# EasyEDA Pro project ProDoc_遥控器_2026-09-13.epro

# Schematic Schematic2

## Sheets
1 MCU: Assembly Variant: Basic; Board Name: Board2; Create Date: 2026-02-01; Page Name: P1; Project Name: stm32_无人机; Schematic Name: Schematic2; Update Date: 2026-02-01; Company: 嘉立创EDA; Page Size: A4; Version: V1.0
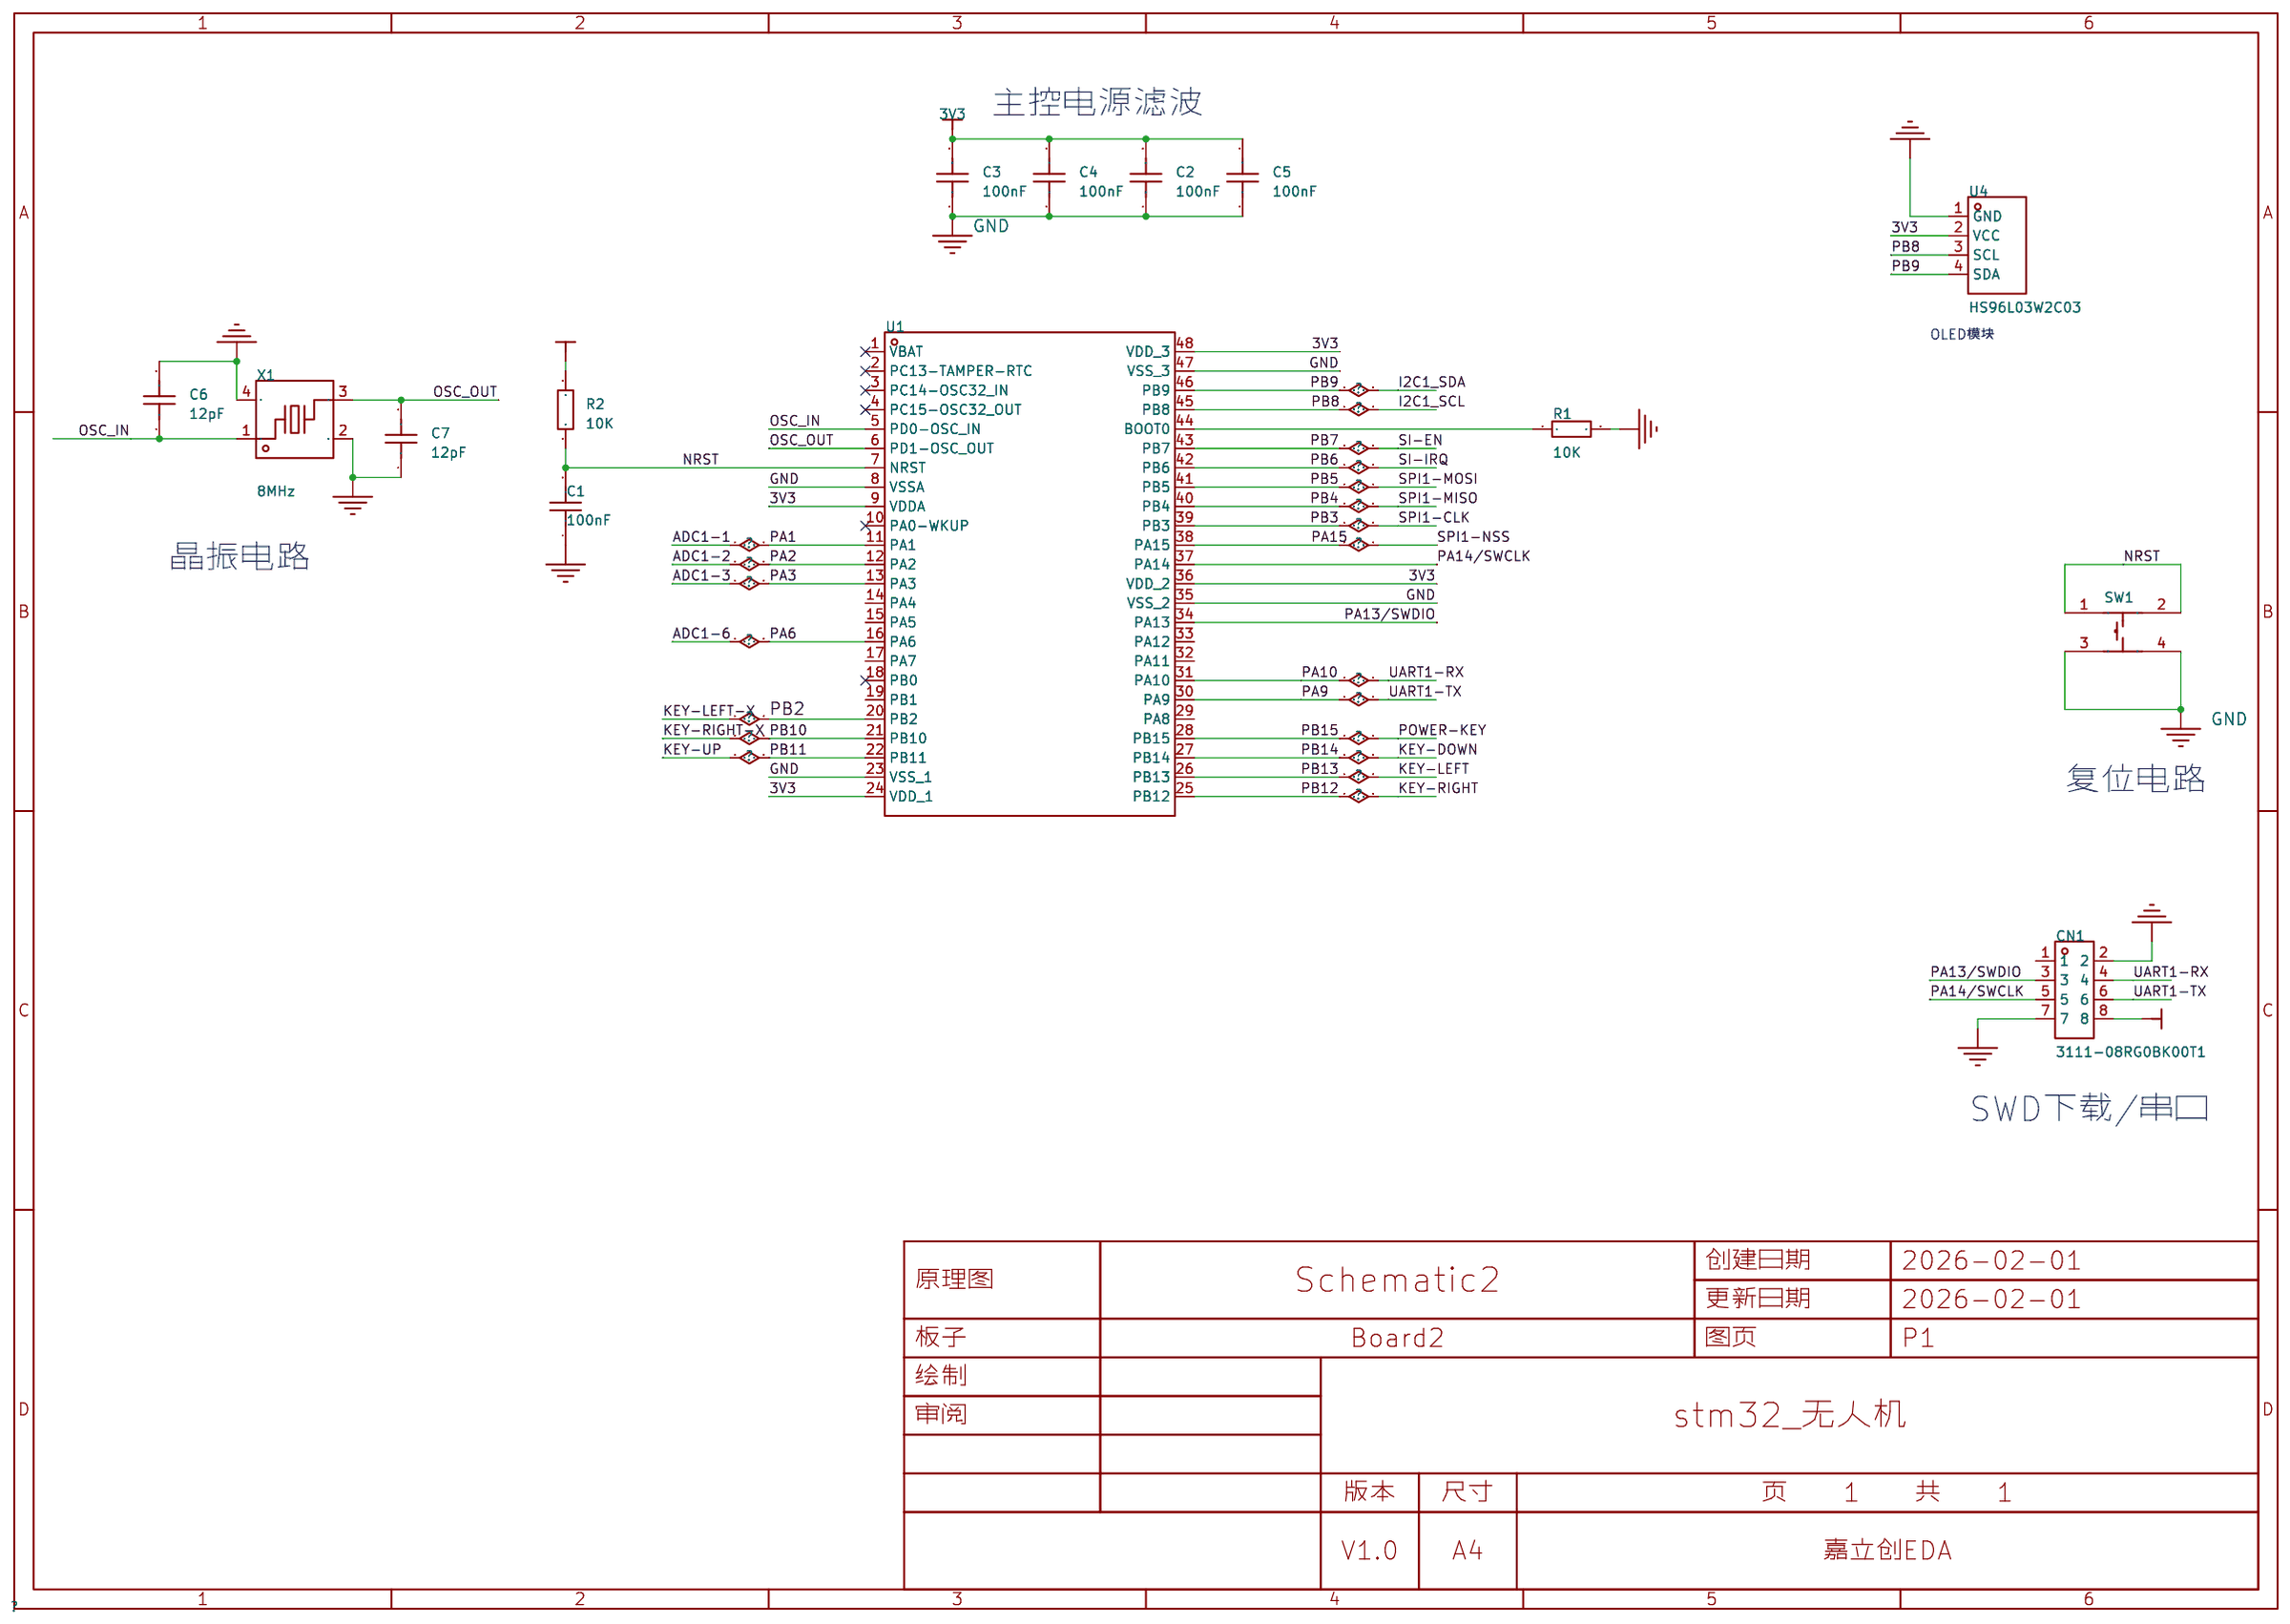
[diagram p0: MCU]
2 摇杆和按键: Board Name: 遥控器
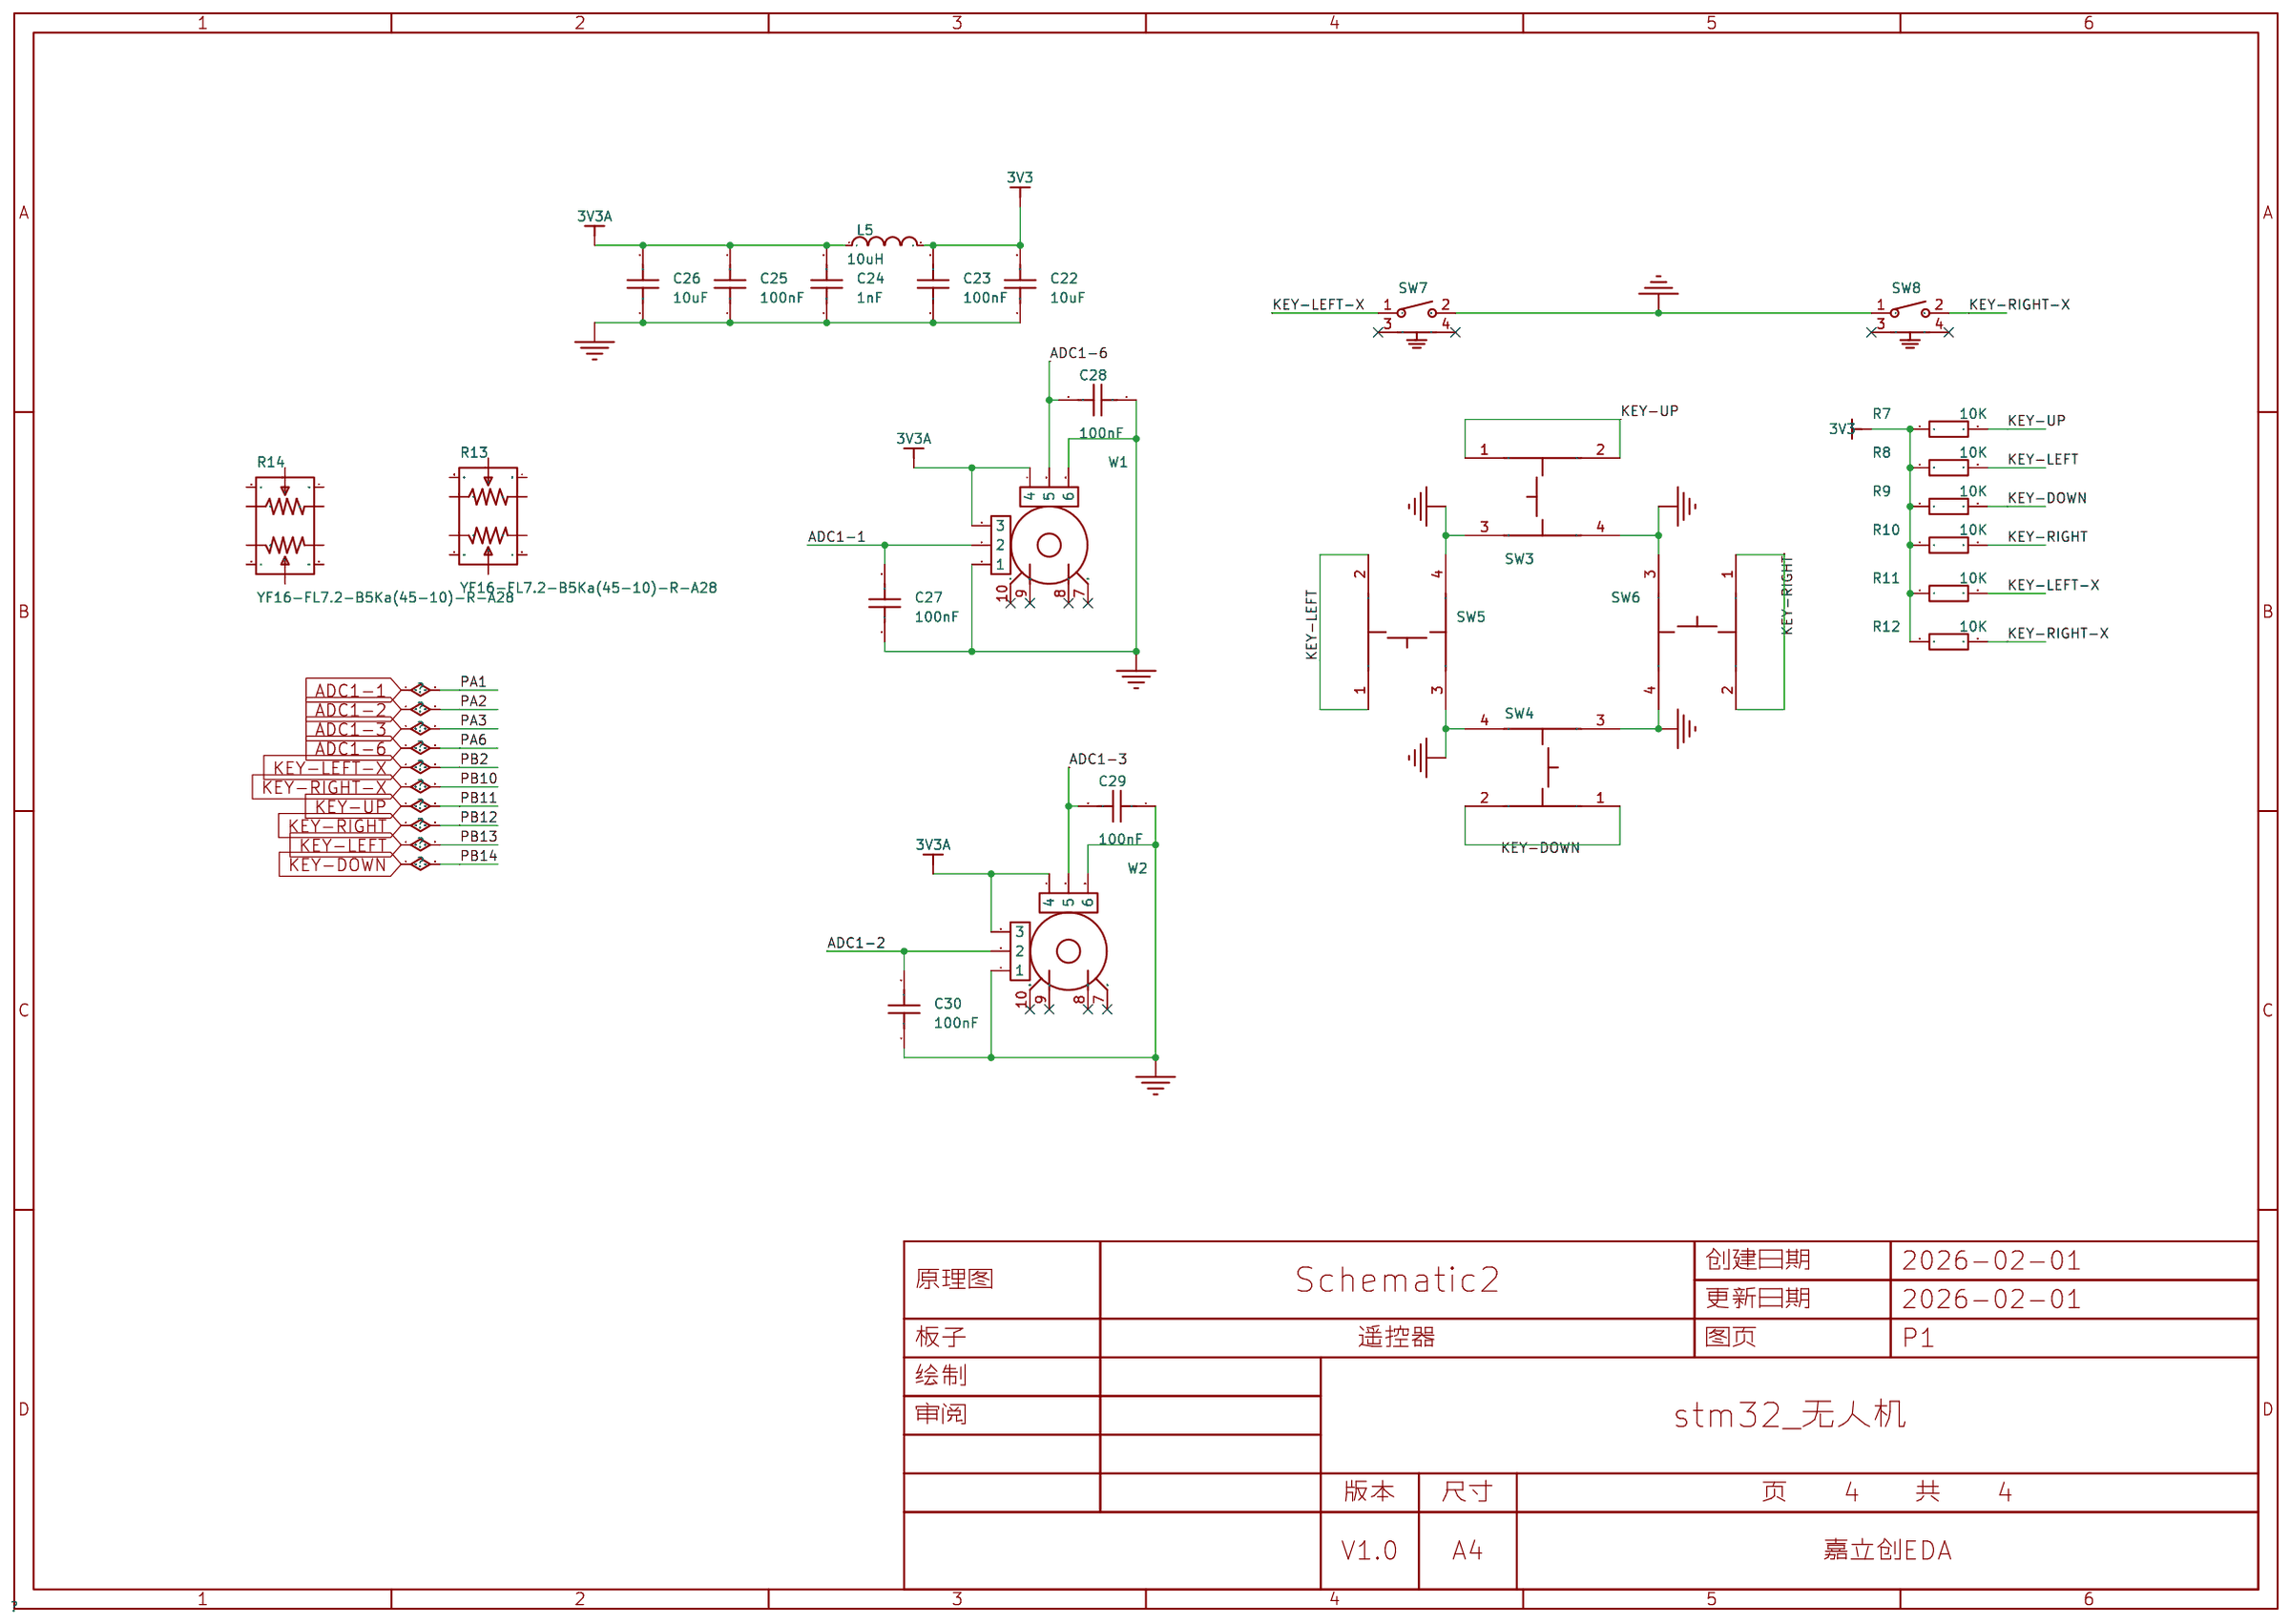
[diagram p1: 摇杆和按键]
3 SI24R1: Board Name: 遥控器
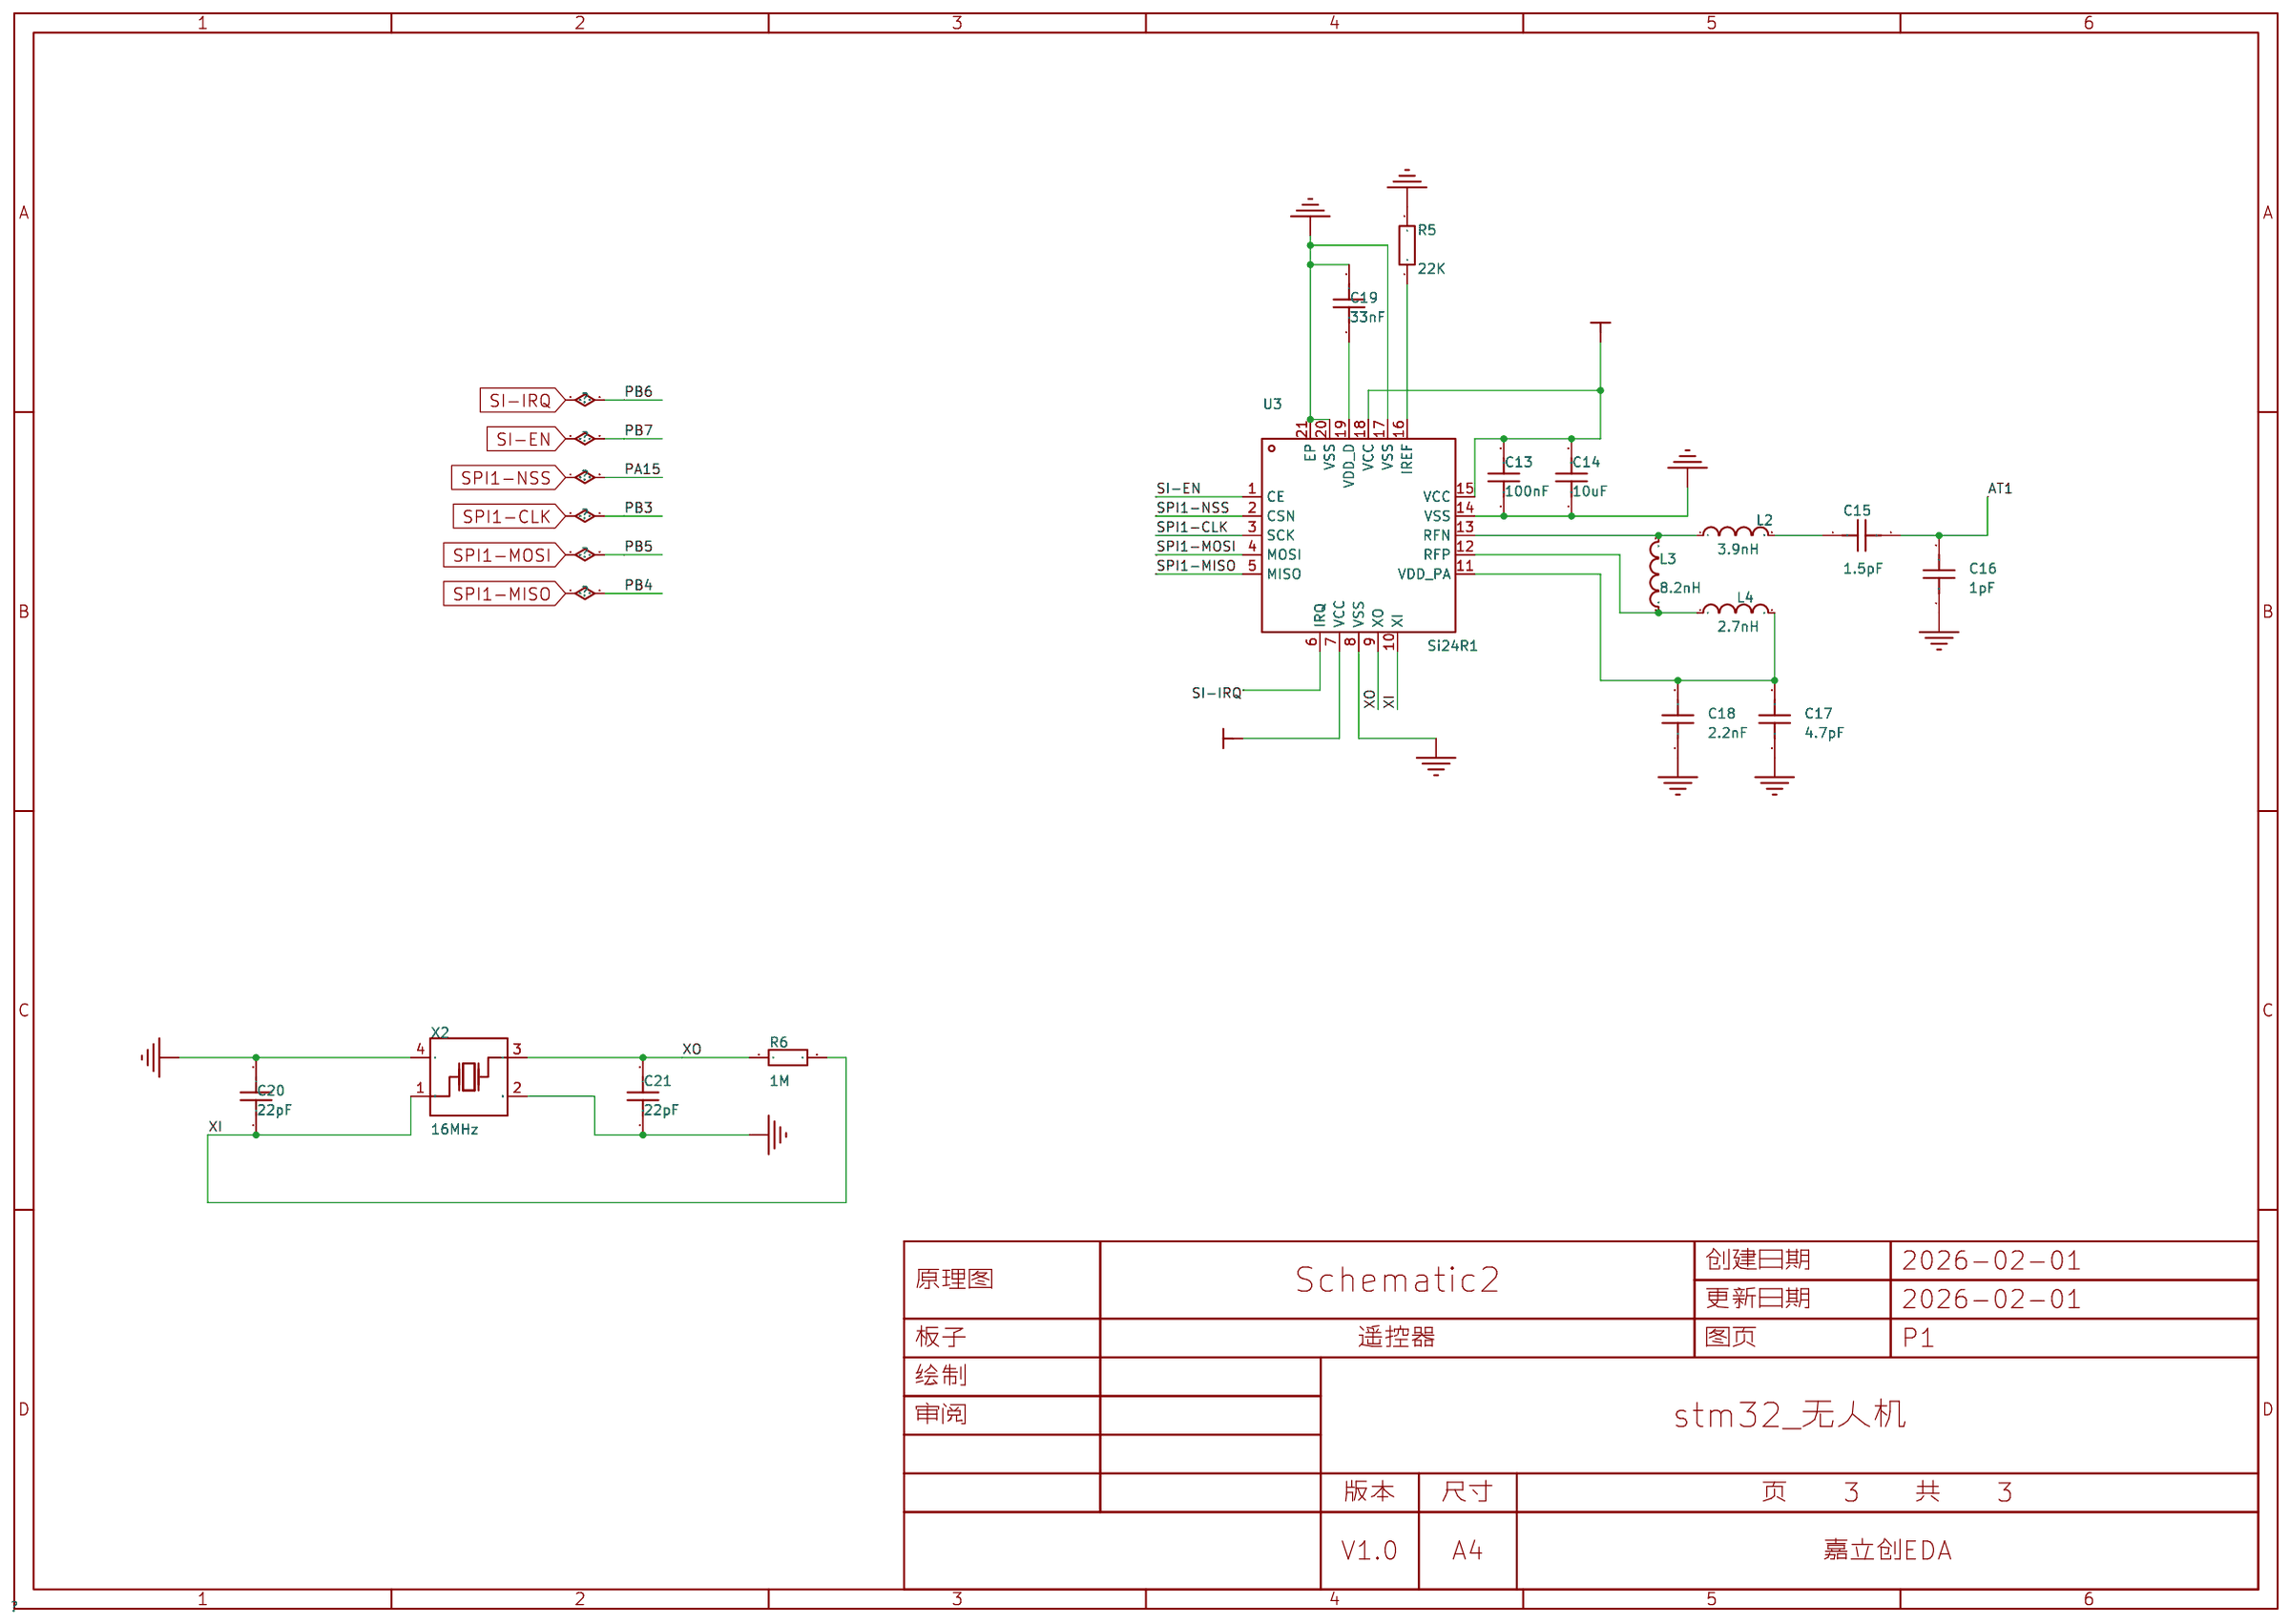
[diagram p2: SI24R1]
4 电源充电管理: Board Name: 遥控器; Page Name: P2
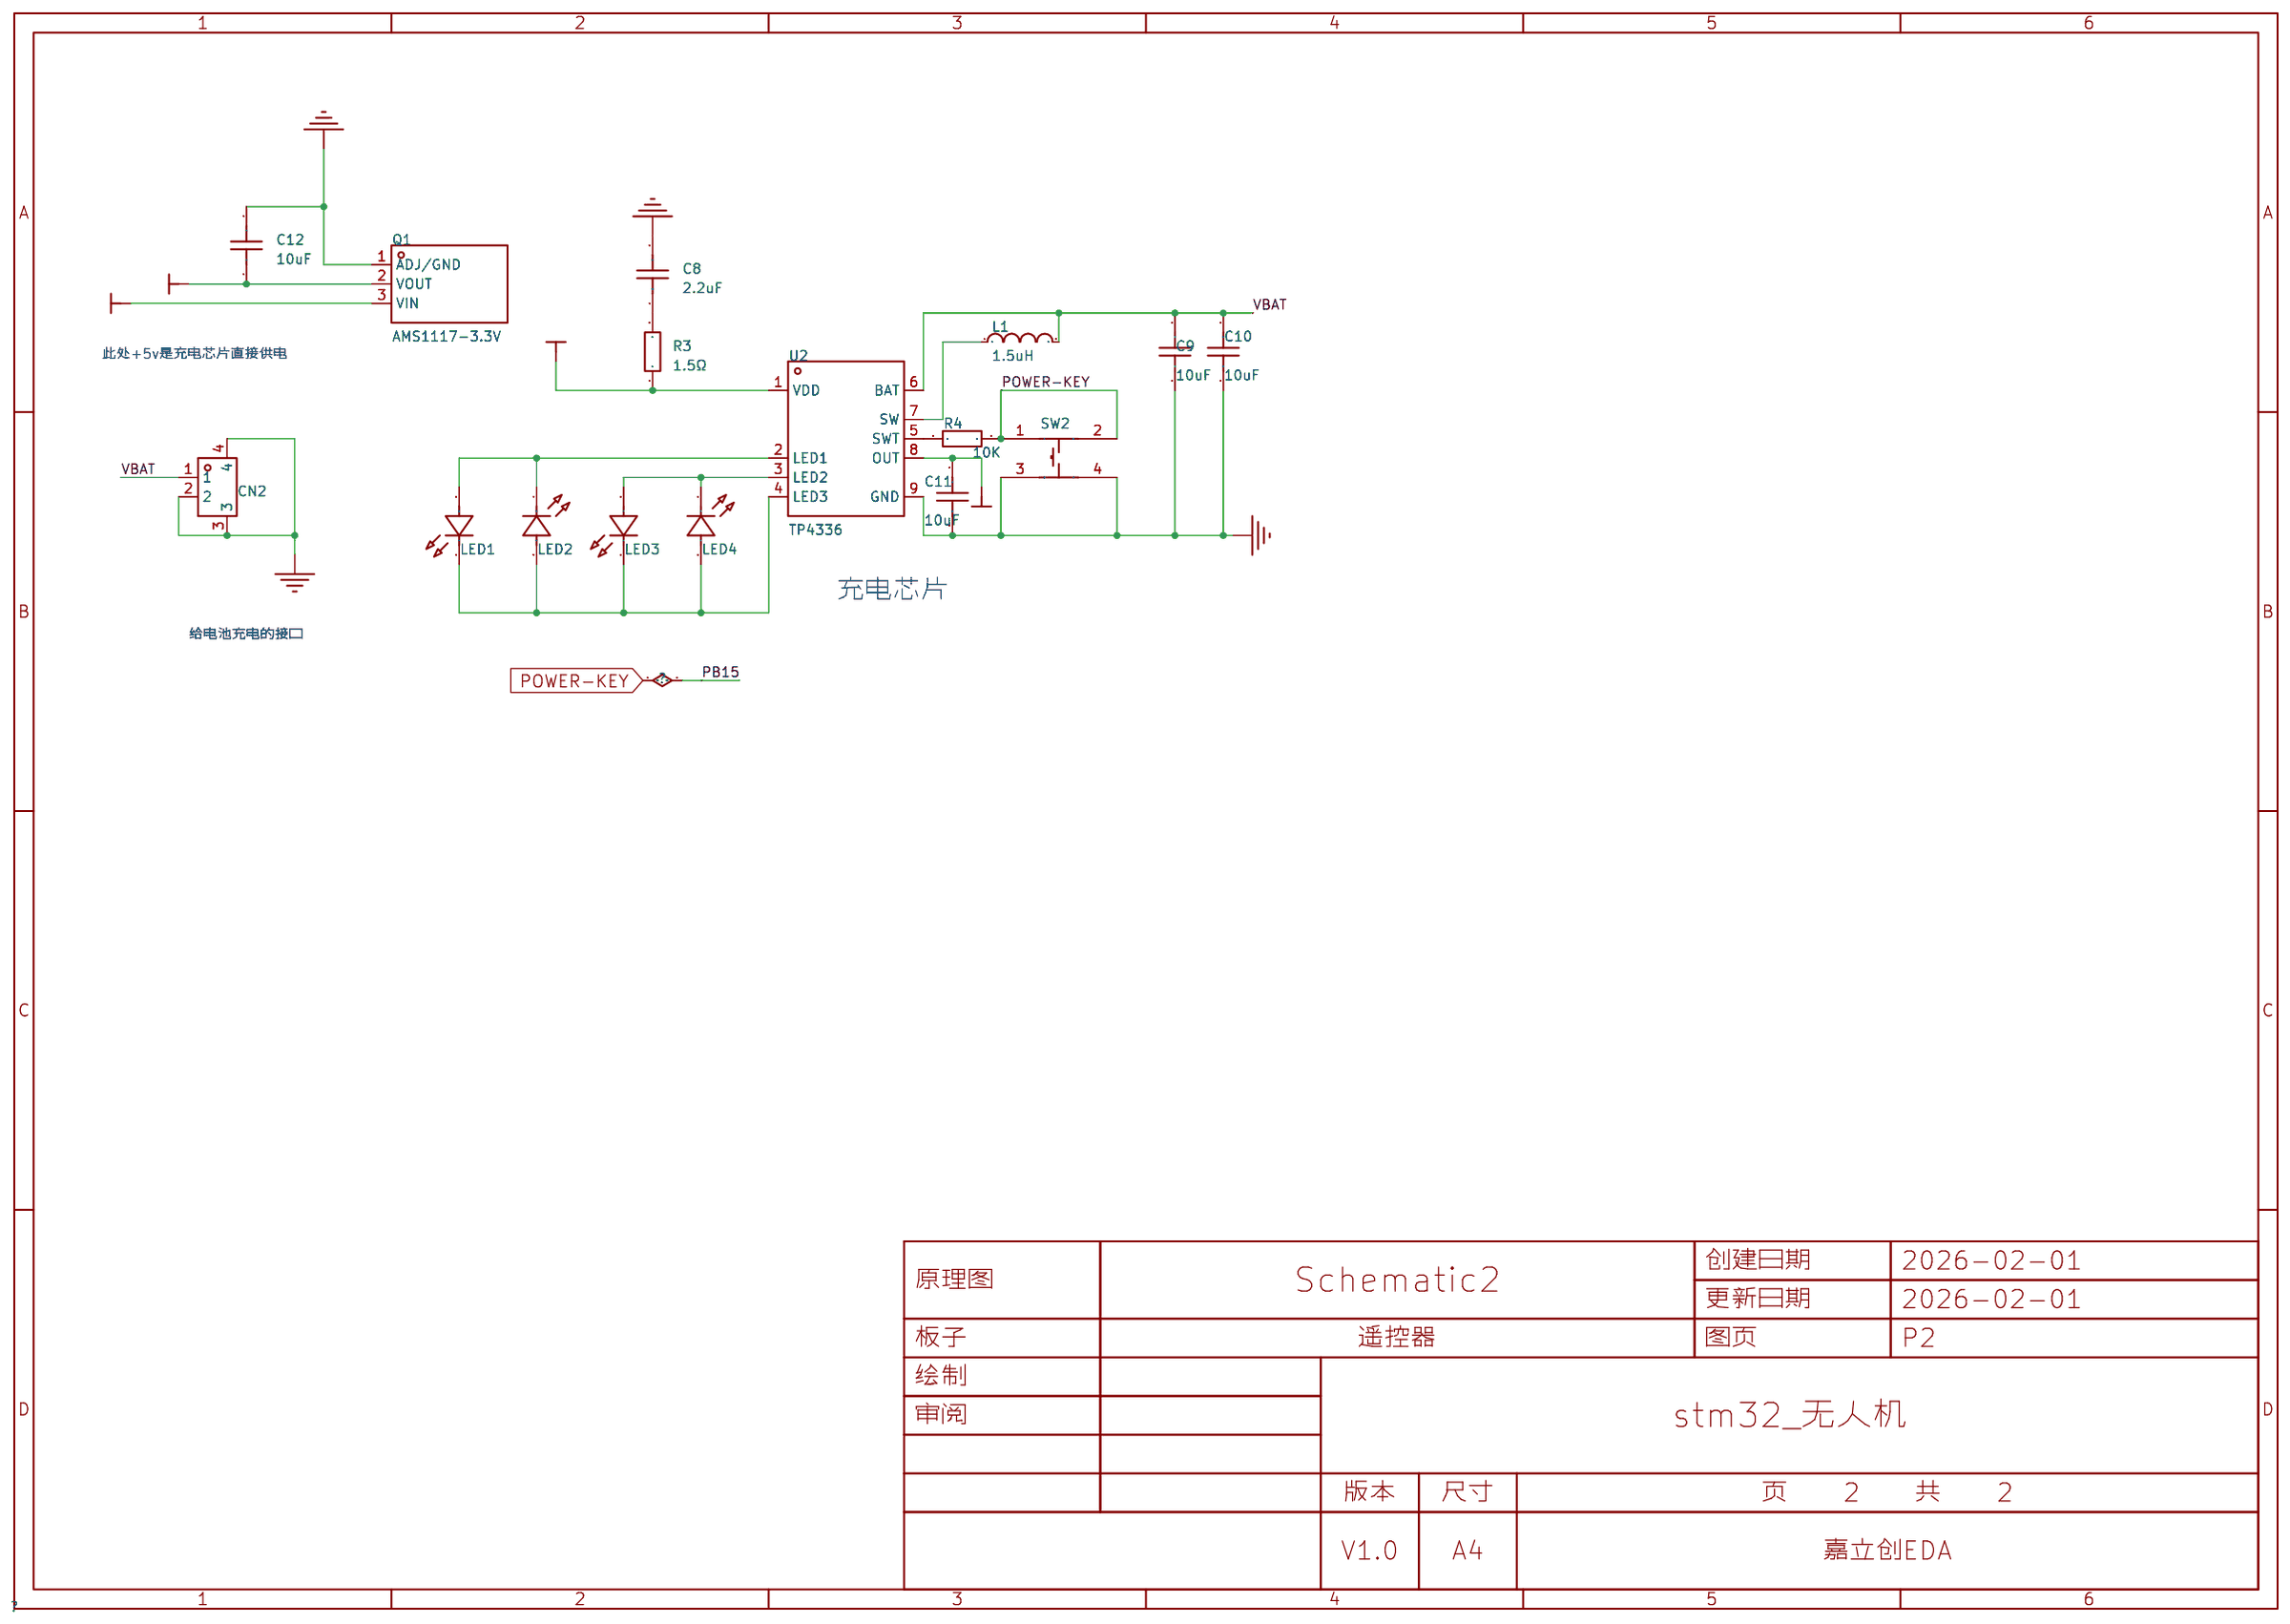
[diagram p3: 电源充电管理]

## Parts
sheet MCU
C1  100nF  [C0603]
C2  100nF  [C0603]
C3  100nF  [C0603]
C4  100nF  [C0603]
C5  100nF  [C0603]
C6  12pF  [C0603]
C7  12pF  [C0603]
CN1  3111-08RG0BK00T1  [CONN-TH_3111-08RG0BK00T1]
R1  10K  [R0603]
R2  10K  [R0603]
SW1  SKRPACE010  [KEY-SMD_4P-L4.2-W3.2-P2.20-LS4.6]
U1  STM32F103C8T6  [LQFP-48_L7.0-W7.0-P0.50-LS9.0-BL]
U4  HS96L03W2C03  [OLED-TH_L27.8-W27.2-P2.54_C9900033791]
X1  8MHz  [CRYSTAL-SMD_4P-L3.2-W2.5-BL-1]
sheet SI24R1
C13  100nF  [C0603]
C14  10uF  [C0603]
C15  1.5pF  [C0603]
C16  1pF  [C0603]
C17  4.7pF  [C0603]
C18  2.2nF  [C0603]
C19  33nF  [C0603]
C20  22pF  [C0603]
C21  22pF  [C0603]
L2  3.9nH  [L0603]
L3  8.2nH  [L0603]
L4  2.7nH  [L0603]
R5  22K  [R0603]
R6  1M  [R0603]
U3  Si24R1  [QFN-20_L4.0-W4.0-P0.50-BL-EP]
X2  16MHz  [CRYSTAL-SMD_4P-L2.5-W2.0-BL-2]
sheet 摇杆和按键
C22  10uF  [C0603]
C23  100nF  [C0603]
C24  1nF  [C0603]
C25  100nF  [C0603]
C26  10uF  [C0603]
C27  100nF  [C0603]
C28  100nF  [C0603]
C29  100nF  [C0603]
C30  100nF  [C0603]
L5  10uH  [L0603]
R7  10K  [R0603]
R8  10K  [R0603]
R9  10K  [R0603]
R10  10K  [R0603]
R11  10K  [R0603]
R12  10K  [R0603]
R13  YF16-FL7.2-B5Ka(45-10)-R-A28  [JOYTICK-TH_YF16-DFL7.2-B5KO-45-10-B5KO-55--RG-A22]
R14  YF16-FL7.2-B5Ka(45-10)-R-A28  [JOYTICK-TH_YF16-DFL7.2-B5KO-45-10-B5KO-55--RG-A22]
SW3  TS-1102S-C-M-B  [KEY-SMD_4P-L6.0-W6.0-P4.50-LS8.6_TS-1102S-C-M-B]
SW4  TS-1102S-C-M-B  [KEY-SMD_4P-L6.0-W6.0-P4.50-LS8.6_TS-1102S-C-M-B]
SW5  TS-1102S-C-M-B  [KEY-SMD_4P-L6.0-W6.0-P4.50-LS8.6_TS-1102S-C-M-B]
SW6  TS-1102S-C-M-B  [KEY-SMD_4P-L6.0-W6.0-P4.50-LS8.6_TS-1102S-C-M-B]
SW7  UK-B02124G90-AQ25Y  [SW-TH_UK-B02124G90-AQ25Y]
SW8  UK-B02124G90-AQ25Y  [SW-TH_UK-B02124G90-AQ25Y]
W1  -  [16*16双路]
W2  -  [16*16双路]
sheet 电源充电管理
C8  2.2uF  [C0603]
C9  10uF  [C0603]
C10  10uF  [C0603]
C11  10uF  [C0603]
C12  10uF  [C0603]
CN2  ZX-XH2.54-2PWT  [CONN-SMD_2P-P2.54_MEGASTAR_ZX-XH2.54-2PWT]
L1  1.5uH  [L0603]
LED1  XL-1005UGC  [LED0402-RD_GREEN]
LED2  XL-1005UGC  [LED0402-RD_GREEN]
LED3  XL-1005UGC  [LED0402-RD_GREEN]
LED4  XL-1005UGC  [LED0402-RD_GREEN]
Q1  AMS1117-3.3V  [SOT-89-3_L4.5-W2.5-P1.50-LS4.2-BR]
R3  1.5Ω  [R0603]
R4  10K  [R0603]
SW2  SKRPACE010  [KEY-SMD_4P-L4.2-W3.2-P2.20-LS4.6]
U2  TP4336  [ESOP-8_L4.9-W3.9-P1.27-LS6.0-BL-EP-1]

## Library data of the parts
C1-C30 = CAP_0603: Supplier Footprint: 0603
CN1 = 3111-08RG0BK00T1: 连接器类型:简牛座;间距:2mm;结构:2x4P;封装形式:弯插;行距:2mm;排数:2;每排PIN数:4;触头材质:黄铜;触头镀层:金;; LCSC Part Name: 2mm 2x4P 排数:2 每排P数:4; Supplier Part: C720751; Manufacturer: Wcon(维峰电子); Supplier Footprint: 弯插,P=2mm; JLCPCB Part Class: 扩展库; Datasheet: https://atta.szlcsc.com/upload/public/pdf/source/20200908/C720751_429ECEF3D5B5C4289EC4F86089830CA0.pdf; Supplier: LCSC; Connector Type: 简牛座; Pitch: 2mm; Structure: 2x4P; Holder Type: 弯插; Row Spacing: 2mm; Number of Rows: 2; Pin Number in each Row: 4; Contact Material: 黄铜; Contact Plating: 金
R1-R12 = Res_0603: Supplier Footprint: 0603
SW1 SW2 = SKRPACE010: 电路结构:单刀单掷;按钮形状:椭圆形按钮;安装方式:立贴;开关长度:4.2mm;开关宽度:3.2mm;开关高度:2.5mm;触点电流:50mA;额定电压:16V;带灯:-;工作寿命:-;; LCSC Part Name: 4.2*3.2*2.5mm 立贴 轻触开关; Supplier Part: C139797; Manufacturer: ALPSALPINE(阿尔卑斯阿尔派); Supplier Footprint: SMD-4P,4.2x3.2mm; JLCPCB Part Class: 扩展库; Datasheet: https://item.szlcsc.com/datasheet/SKRPACE010/151122.html; Supplier: LCSC; Circuit: 单刀单掷; Actuator Style: 椭圆形按钮; Mounting Type: 立贴; Length: 4.2mm; Width: 3.2mm; Switch Height: 2.5mm; Contact Current: 50mA; Voltage Rating: 16V
U1 = STM32F103C8T6: LCSC Part Name: STM32F103C8T6 MSL=3; Supplier Part: C8734; Manufacturer: ST(意法半导体); Supplier Footprint: LQFP-48(7x7); JLCPCB Part Class: 扩展库; Datasheet: https://atta.szlcsc.com/upload/public/pdf/source/20220812/8363ACEC51AD55ECEB84799464F7CB85.pdf; Supplier: LCSC; CPU Core: CM3; Program Storage Size: 64KB; RAM Size: 20KB; GPIO Ports Number: 37; Operating Voltage Range: 2V~3.6V; CPU Maximum Speed: 72MHz; Program Memory Type: FLASH; Operating Temperature Range: -40℃~+85℃; ADC (Bit): 12bit; Universal Serial Bus: 有; Peripheral/Function: 看门狗；DMA；看门狗；片载温度传感器; Watchdog: 有; Infrared Data Association: 有; Low-Voltage Detect: 有; Direct Memory Access: 有; Internal Oscillator: 有
U4 = HS96L03W2C03: 核心芯片:SSD1315芯片;接口类型:I2C;尺寸(inch):0.96;像素分辨率:128x64;; LCSC Part Name: 0.96寸OLED显示屏窄白光IIC; Supplier Part: C5248080; Manufacturer: HS(汉昇); JLCPCB Part Class: Extended Part; Datasheet: https://item.szlcsc.com/datasheet/HS96L03W2C03/5960631.html; Supplier: LCSC; Controller Type: SSD1315芯片; Interface: I2C; Size: 0.96; Dot Pixels: 128x64; Operating Temperature: -40℃~+70℃; Type of Drive: 无源(PMOLED); Display Range: 21.744x10.864mm; Display Color: 白色; Voltage - Supply: 2.8V~3.3V; Luminance: 180cd/m2
X1 = XL2EL89COI-111YLC-8M: LCSC Part Name: 8MHz ±10ppm 12pF; Supplier Part: C2973805; Manufacturer: YXC(扬兴晶振); Supplier Footprint: SMD3225-4P; JLCPCB Part Class: 扩展库; Datasheet: https://atta.szlcsc.com/upload/public/pdf/source/20240329/19D5F850207469550BEB00D7DFEDBC7A.pdf; Supplier: LCSC; Crystal Type: 贴片晶振; Normal temperature Frequency Tolerance: ±10ppm; External load capacitor: 12pF; Frequency Stability(Full temperature range): ±20ppm; Equivalent Series Resistance (ESR): 150Ω; Operating Temperature: -40℃~+85℃
L1-L5 = L_0603
U3 = Si24R1: 频率范围:2.4GHz~2.525GHz;接口类型:SPI;应用领域:ISM;数据速率:2Mbps;灵敏度:-96dBm;典型应用频率:2.4GHz;; LCSC Part Name: 超低功耗、高性能2.4 GHz GFSK收发器; Supplier Part: C14436; Manufacturer: 南京中科微; Supplier Footprint: QFN-20-EP(4x4); JLCPCB Part Class: 扩展库; Datasheet: https://item.szlcsc.com/datasheet/Si24R1/15098.html; Supplier: LCSC; Frequency Range: 2.4GHz~2.525GHz; Interface: SPI; Voltage - Supply: 1.9V~3.6V; Applications: ISM; Output Power: 7dBm; Data Rate: 2Mbps; Current Of Transmitting: 12mA; Sensitivity: -96dBm; Receive Current: 15mA; Typical Application Frequency: 2.4GHz; Operating Temperature: -40℃~+85℃; Type: 收发器
X2 = SX25Y016000B91T: 晶振类型:-;频率:-;负载电容:-;; LCSC Part Name: 2520 16M 9PF  10ppm  -20 -75℃; Supplier Part: C271644; Manufacturer: TKD(泰晶); Supplier Footprint: SMD2520-4P; JLCPCB Part Class: 扩展库; Datasheet: https://item.szlcsc.com/datasheet/SX25Y016000B91T/260707.html; Supplier: LCSC
R13 R14 = YF16-FL7.2-B5Ka(45-10)-R-A28: 摇杆电位器、操纵杆电位器，适用于航模玩具遥控器电位器、3D摇杆PS4手柄游戏机、无人机摇杆电位器、VR摇杆电位器、工业控制器; LCSC Part Name: 摇杆系列电位器; Supplier Part: C37323739; Manufacturer: YTL(亚特联); Supplier Footprint: 插件-10P,20.3x19.8mm; JLCPCB Part Class: Extended Part; Datasheet: https://item.szlcsc.com/datasheet/YF16-FL7.2-B5Ka(45-10)-R-A28/39051746.html; Supplier: LCSC; Total Resistance: 5kΩ; Toggle reset: 自复位; Mounting Type: 直插; Operating Temperature: -10℃~+70℃; Voltage Rating: 12V
SW3-SW6 = TS-1102S-C-M-B: 电路结构:单刀单掷;按钮形状:圆形按钮;作用力:2.6N;安装方式:立贴;开关长度:6mm;开关宽度:6mm;开关高度:10mm;带支架:不带支架;触点电流:50mA;额定电压:12V;带灯:无;工作寿命:30万次;; LCSC Part Name: 6*6*10mm 立贴 轻触开关; Supplier Part: C381050; Manufacturer: XKB Connection(中国星坤); Supplier Footprint: SMD-4P,6x6mm; JLCPCB Part Class: 扩展库; Datasheet: https://item.szlcsc.com/datasheet/TS-1102S-C-M-B/353282.html; Supplier: LCSC; Circuit: 单刀单掷; Actuator Style: 圆形按钮; Operating Force: 2.6N; Mounting Type: 立贴; Length: 6mm; Width: 6mm; Switch Height: 10mm; with Bracket: 不带支架; Contact Current: 50mA; Voltage Rating: 12V; Actuator/Cap Color: 黑色; With Lamp: 无; Life: 30万次; Operating Temperature: -20℃~+70℃
SW7 SW8 = UK-B02124G90-AQ25Y: 电路结构:单刀单掷;按钮形状:圆形按钮;作用力:2.5N;安装方式:弯插;开关长度:6mm;开关宽度:6mm;开关高度:9mm;带支架:带支架;触点电流:50mA;额定电压:12V;带灯:无;工作寿命:10万次;; LCSC Part Name: 6*6*9mm 卧插 轻触开关; Supplier Part: C493238; Manufacturer: USAKRO(美韩); Supplier Footprint: 弯插,6x6mm; JLCPCB Part Class: 扩展库; Datasheet: https://item.szlcsc.com/datasheet/UK-B02124G90-AQ25Y/503894.html; Supplier: LCSC; Circuit: 单刀单掷; Actuator Style: 圆形按钮; Operating Force: 2.5N; Mounting Type: 弯插; Length: 6mm; Width: 6mm; Switch Height: 9mm; with Bracket: 带支架; Contact Current: 50mA; Voltage Rating: 12V; Actuator/Cap Color: 黑色; With Lamp: 无; Termination Style: PC引脚; Life: 10万次; Operating Temperature: -20℃~+70℃
W1 W2 = 双路摇杆
CN2 = ZX-XH2.54-2PWT: 插针结构:1x2P;间距:2.5mm;安装方式:卧贴;参考系列:XH;总PIN数:2P;排数:1;每排PIN数:2;行距:-;额定电流:3A;触头材质:黄铜;触头镀层:锡;工作温度:-25℃~+85℃;; LCSC Part Name: 1x2P 间距:2.5mm 卧贴 系列:XH; Supplier Part: C7429671; Manufacturer: Megastar(兆星); Supplier Footprint: SMD,P=2.5mm,卧贴; JLCPCB Part Class: 扩展库; Datasheet: https://item.szlcsc.com/datasheet/ZX-XH2.54-2PWT/8427588.html; Supplier: LCSC; Pins Structure: 1x2P; Pitch: 2.5mm; Mounting Type: 卧贴; Reference Series: XH; Number of Pins: 2P; Number of Rows: 1; Number of PINs Per Row: 2; Current Rating: 3A; Contact Material: 黄铜; Contact Plating: 锡; Operating Temperature: -25℃~+85℃; Voltage Rating: 250V; Plastic Material: LCP; Supplementary Features: 辅助焊脚; Color: 米色; Z-Height of the Board: 6.2mm; X-Length of Bottom Edge on Board (Spacing Line): 10mm; Y-Width of Bottom Edge on Board: 7.8mm
LED1-LED4 = XL-1005UGC_C965793: 发光颜色:翠绿色;正向压降(Vf):3V;功率:80mW;正向电流:25mA;波长:516nm~531nm;透镜颜色:无色透明透镜;色温:-;发光强度:249mcd;发光角度:120°;载带方式:正贴;工作温度:-40℃~+85℃;; LCSC Part Name: 0402翠绿贴片式发光二极管; Supplier Part: C965793; Manufacturer: XINGLIGHT(成兴光); Supplier Footprint: 0402; JLCPCB Part Class: 扩展库; Datasheet: https://item.szlcsc.com/datasheet/XL-1005UGC/1051402.html; Supplier: LCSC; Illumination Color: 翠绿色; Voltage - Forward(Vf): 3V; Power(Watts): 80mW; Forward Current: 25mA; Wavelength - Dominant: 516nm~531nm; Peak Wavelength: 531nm; Lens Color: 无色透明透镜; Luminous Intensity: 249mcd; Viewing Angle: 120°; Mounting Style: 正贴; Operating Temperature: -40℃~+85℃
Q1 = AMS1117-3.3V_C5120796: 输出类型:固定;工作电压:18V;输出电压:3.3V;输出电流:1A;输出极性:正极;; LCSC Part Name: 输入18V 输出3.3V 1A; Supplier Part: C5120796; Manufacturer: MSKSEMI(美森科); Supplier Footprint: SOT-89; JLCPCB Part Class: 扩展库; Datasheet: https://item.szlcsc.com/datasheet/AMS1117-3.3V/5706251.html; Supplier: LCSC; Output Type: 固定; Voltage - Supply: 18V; Output Voltage: 3.3V; Output Current: 1A; Voltage Dropout: 1.4V@(1A); standby current: 12mA; Operating Temperature: 0℃~+125℃; Output Configuration: 正极; Number of Outputs: 1
U2 = TP4336: Supplier Part: C29075510; Manufacturer: TPOWER(天源); Supplier Footprint: ESOP-8L; JLCPCB Part Class: 扩展库; Datasheet: https://item.szlcsc.com/datasheet/TP4336/30801980.html; Supplier: LCSC

## Nets
3V3: C2.2 C3.2 C4.2 C5.2 C12.1 C13.2 C14.2 C22.2 C23.2 L5.2 Q1.2(VOUT) R2.2 R7.1 R8.1 R9.1 R10.1 R11.1 R12.1 U1.9(VDDA) U1.24(VDD_1) U1.36(VDD_2) U1.48(VDD_3) U3.7(VCC) U3.15(VCC) U3.18(VCC) U4.2(VCC)
3V3A: C24.2 C25.2 C26.2 L5.1 W1.3 W1.4 W2.3 W2.4
+5V: C11.2 Q1.3(VIN) U2.8(OUT)
GND: C1.1 C2.1 C3.1 C4.1 C5.1 C6.2 C7.1 C8.2 C9.1 C10.1 C11.1 C12.2 C13.1 C14.1 C16.1 C17.1 C18.1 C19.2 C20.2 C21.1 C22.1 C23.1 C24.1 C25.1 C26.1 C27.1 C28.1 C29.1 C30.1 CN1.2 CN1.7 CN2.2 CN2.3 CN2.4 Q1.1(ADJ/GND) R1.2 R5.2 SW1.3 SW1.4 SW2.3 SW2.4 SW3.3 SW3.4 SW4.3 SW4.4 SW5.3 SW5.4 SW6.3 SW6.4 SW7.2 SW8.1 U1.8(VSSA) U1.23(VSS_1) U1.35(VSS_2) U1.47(VSS_3) U2.9(GND) U3.8(VSS) U3.14(VSS) U3.17(VSS) U3.20(VSS) U3.21(EP) U4.1(GND) W1.1 W1.6 W2.1 W2.6 X1.2(GND) X1.4(GND) X2.2(GND) X2.4(GND)
VBAT: C9.2 C10.2 CN2.1 L1.2 U2.6(BAT)
VCC: CN1.8 R3.1 U2.1(VDD)
ADC1-1: C27.2 U1.11(PA1) W1.2
ADC1-2: C30.2 U1.12(PA2) W2.2
ADC1-3: C29.2 U1.13(PA3) W2.5
ADC1-6: C28.2 U1.16(PA6) W1.5
AT1: C15.2 C16.2
I2C1_SCL: U1.45(PB8) U4.3(SCL)
I2C1_SDA: U1.46(PB9) U4.4(SDA)
KEY-DOWN: R9.2 SW4.1 SW4.2 U1.27(PB14)
KEY-LEFT: R8.2 SW5.1 SW5.2 U1.26(PB13)
KEY-LEFT-X: R11.2 SW7.1 U1.20(PB2)
KEY-RIGHT: R10.2 SW6.1 SW6.2 U1.25(PB12)
KEY-RIGHT-X: R12.2 SW8.2 U1.21(PB10)
KEY-UP: R7.2 SW3.1 SW3.2 U1.22(PB11)
NRST: C1.2 R2.1 SW1.1 SW1.2 U1.7(NRST)
OSC_IN: C6.1 U1.5(PD0-OSC_IN) X1.1
OSC_OUT: C7.2 U1.6(PD1-OSC_OUT) X1.3
PA9: CN1.6 U1.30(PA9)
PA10: CN1.4 U1.31(PA10)
PA13/SWDIO: CN1.3 U1.34(PA13)
PA14/SWCLK: CN1.5 U1.37(PA14)
PA15: U1.38(PA15) U3.2(CSN)
PB3: U1.39(PB3) U3.3(SCK)
PB4: U1.40(PB4) U3.5(MISO)
PB5: U1.41(PB5) U3.4(MOSI)
PB6: U1.42(PB6) U3.6(IRQ)
PB7: U1.43(PB7) U3.1(CE)
PB15: R4.2 SW2.1 SW2.2 U1.28(PB15)
XI: C20.1 R6.2 U3.10(XI) X2.1(OSC1)
XO: C21.2 R6.1 U3.9(XO) X2.3(OSC2)
$1N9: R4.1 U2.5(SWT)
$1N10: L1.1 U2.7(SW)
$1N14: LED3.2(A) LED4.1(K) U2.3(LED2)
$1N15: LED1.1(K) LED2.2(A) LED3.1(K) LED4.2(A) U2.4(LED3)
$1N16: LED1.2(A) LED2.1(K) U2.2(LED1)
$1N18: C8.1 R3.2
$2N41: R1.1 U1.44(BOOT0)
$3N6: R5.1 U3.16(IREF)
$3N7: C19.1 U3.19(VDD_D)
$3N11: C17.2 C18.2 L4.2 U3.11(VDD_PA)
$3N14: L3.1 L4.1 U3.12(RFP)
$3N15: L2.1 L3.2 U3.13(RFN)
$3N16: C15.1 L2.2

Not connected (* = marked no-connect by the designer): CN1 1; R13 1 2 3 4 5 6 7(shell) 8(shell) 9(shell) 10(shell); R14 1 2 3 4 5 6 7(shell) 8(shell) 9(shell) 10(shell); SW7 3(EP)* 4(EP)*; SW8 3(EP)* 4(EP)*; U1 1(VBAT)* 2(PC13-TAMPER-RTC)* 3(PC14-OSC32_IN)* 4(PC15-OSC32_OUT)* 10(PA0-WKUP)* 14(PA4) 15(PA5) 17(PA7) 18(PB0)* 19(PB1) 29(PA8) 32(PA11) 33(PA12); W1 7(GND)* 8(GND)* 9(GND)* 10(GND)*; W2 7(GND)* 8(GND)* 9(GND)* 10(GND)*

## Notes on the sheets
sheet 1
- 主控电源滤波
- OLED模块
- 晶振电路
- 复位电路
- SWD下载/串口
sheet 4
- 此处+5v是充电芯片直接供电
- 充电芯片
- 给电池充电的接口

# Board PCB2
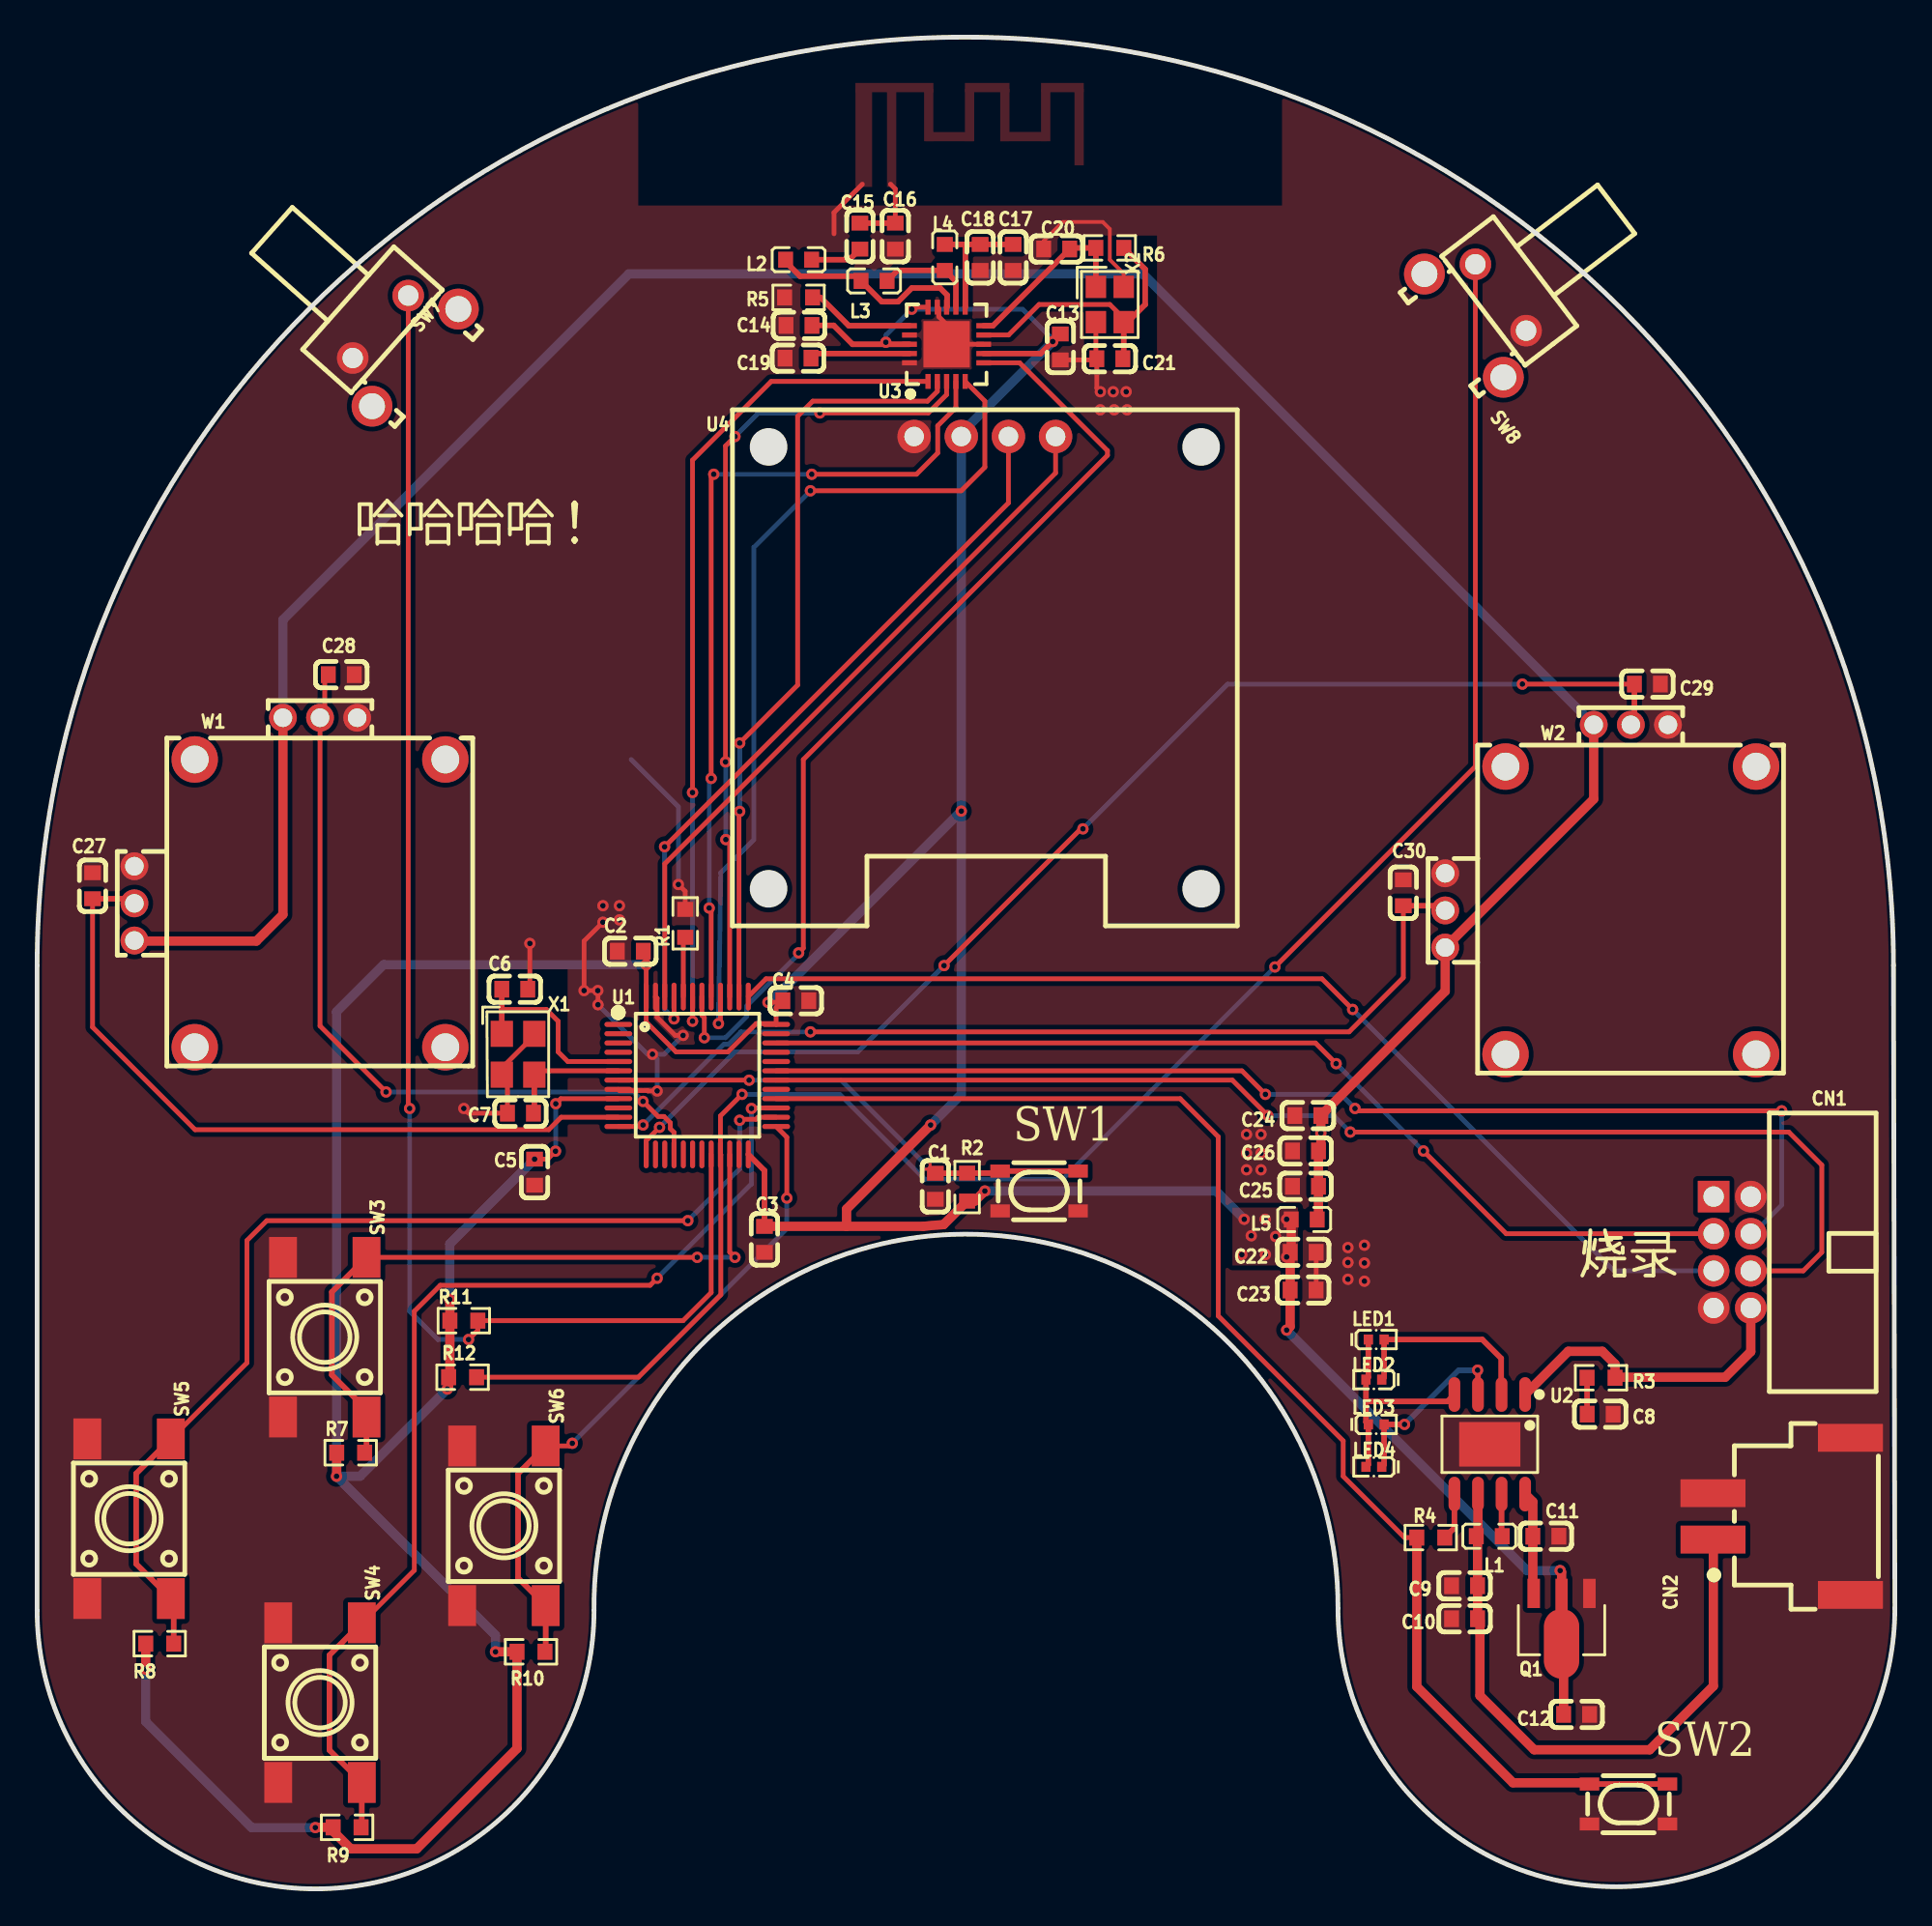
[diagram p4: board, top side]
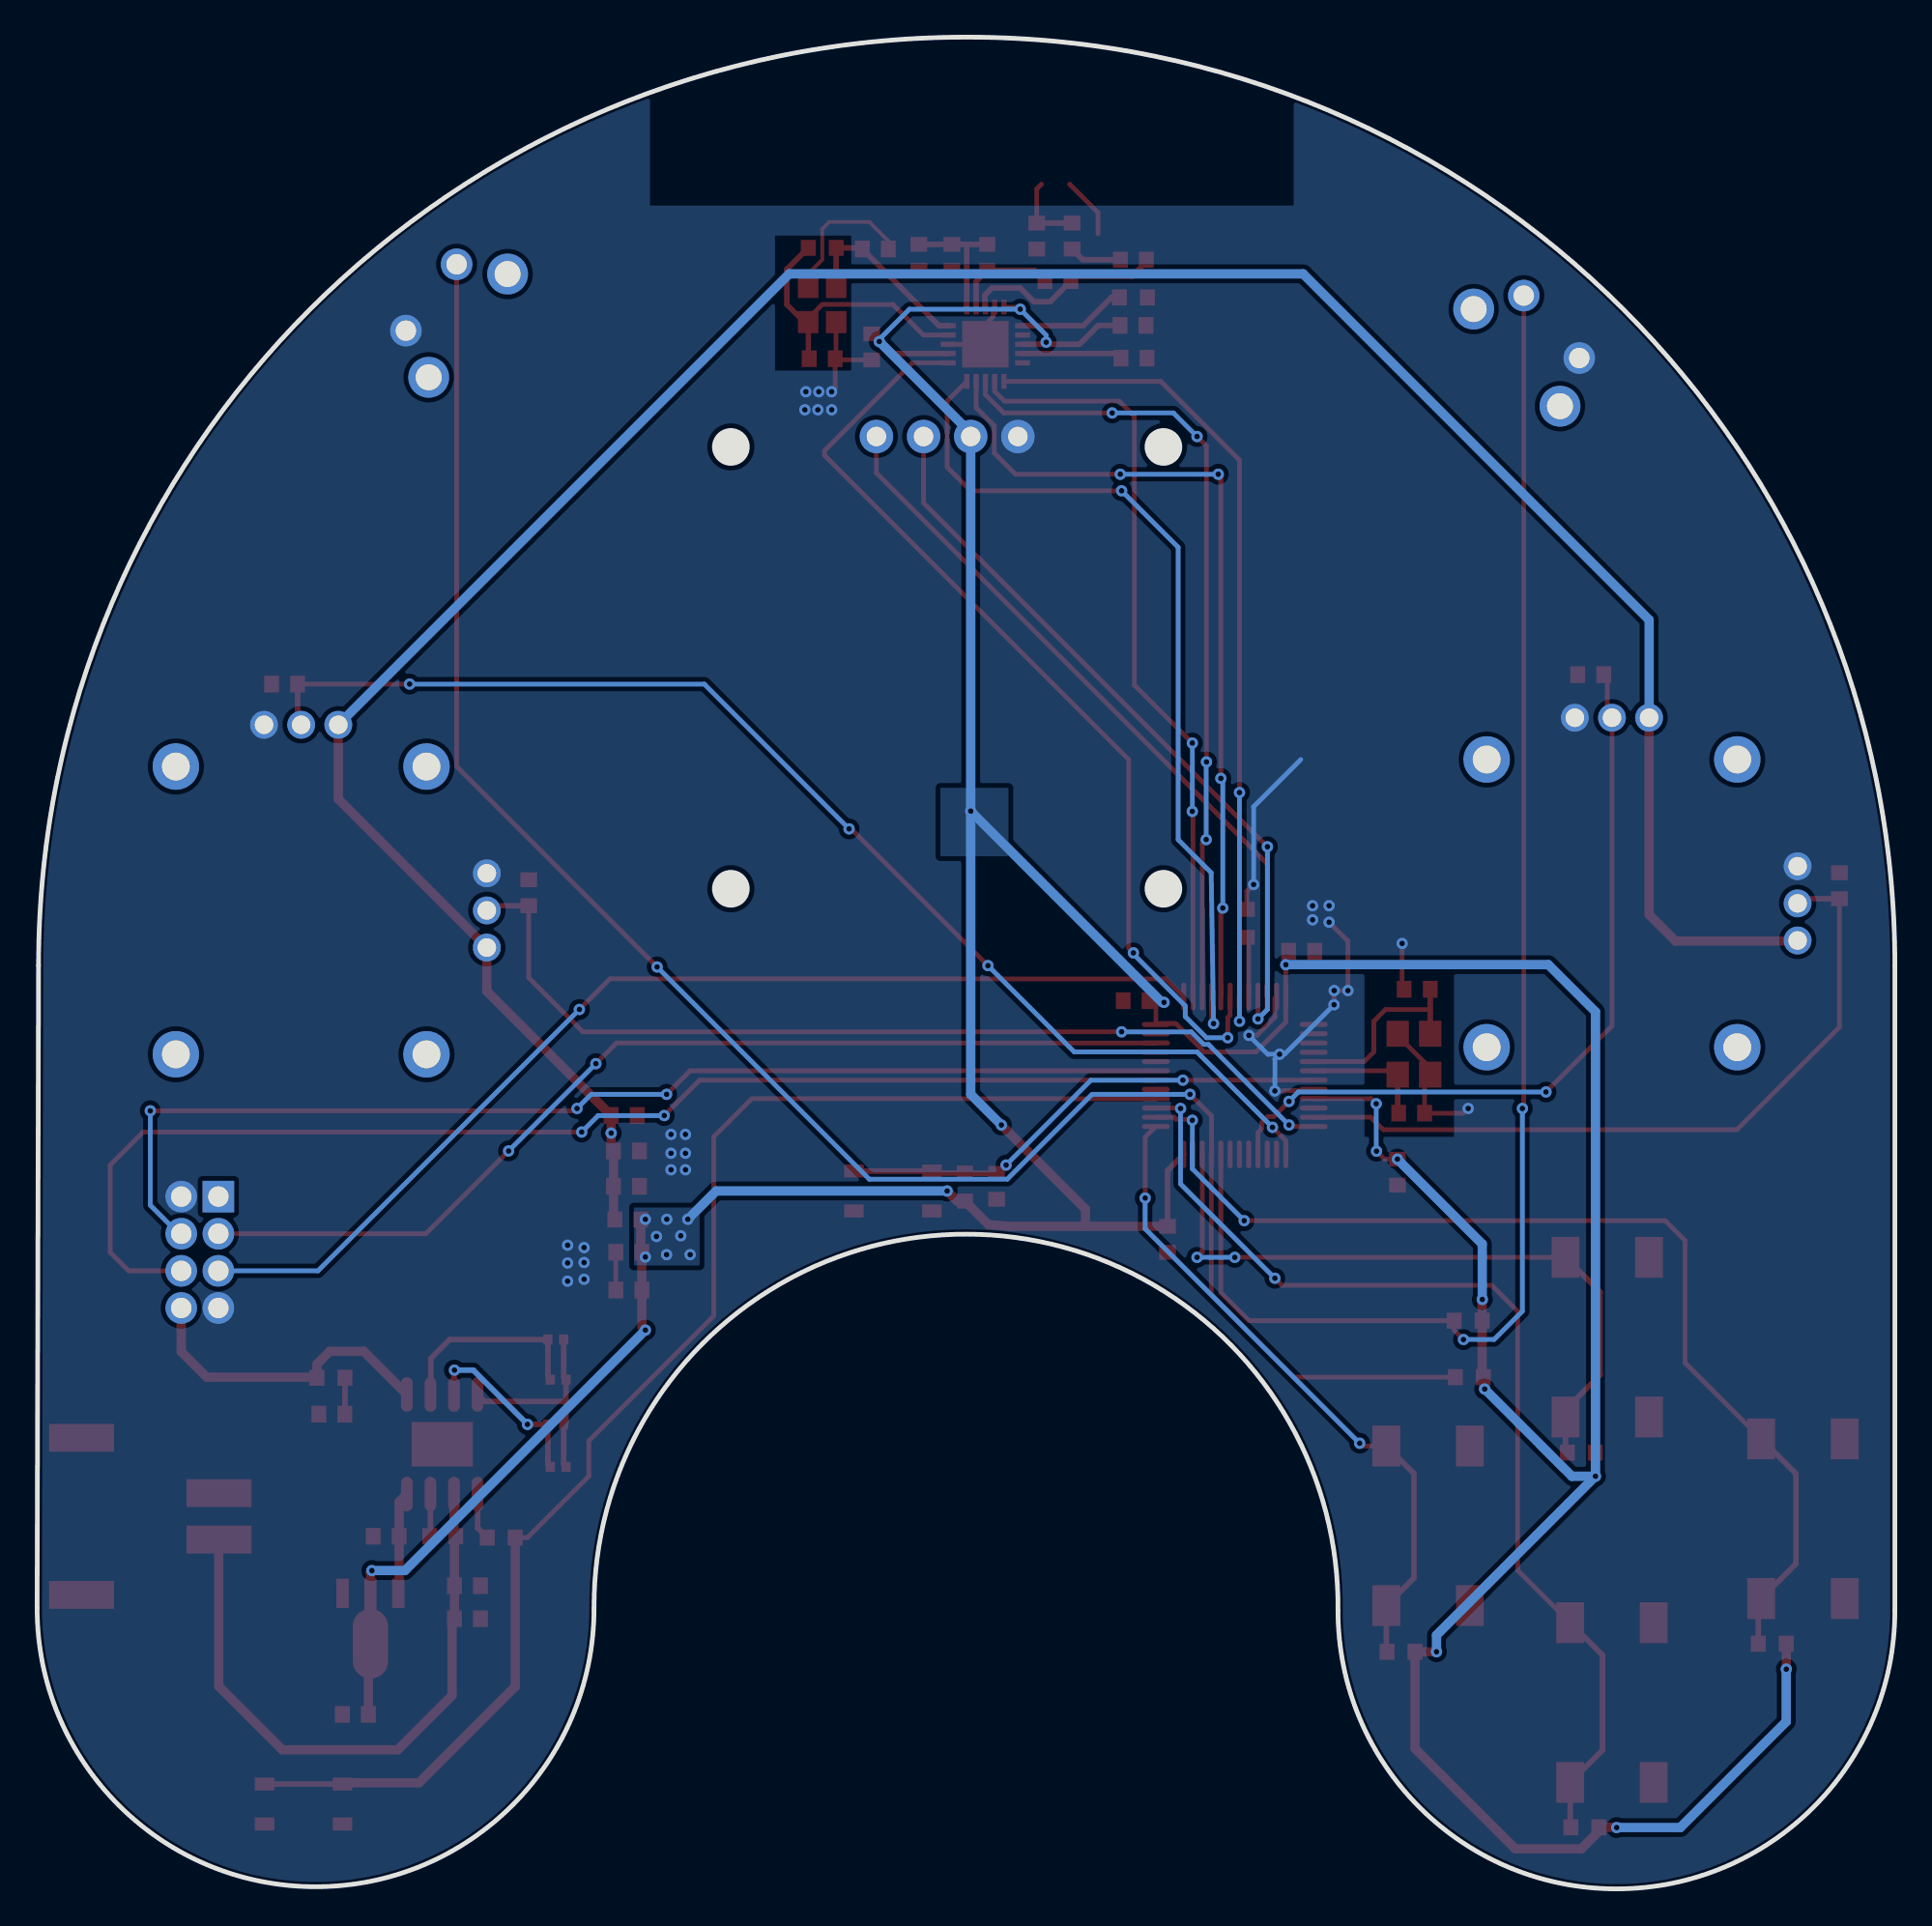
[diagram p5: board, bottom side, seen from below]

Outline 100.08 x 99.75 mm; copper layers: Top Layer, Bottom Layer. Coordinates in mm from the lower left corner of the outline.
Outline path: 0,49.75 0,15 arc(15,0) 30,15 arc(49.98,35.27) 70.08,15.12 arc(85.08,0.12) 100.08,15.12 100,49.75 arc(50,99.75) 0,49.75
Stack: Top Layer 0.035mm / Dielectric1 1.51mm FR4 er 4.5 / Bottom Layer 0.035mm

## Design rules (mm)
spacing copperThickness1oz (default): track to track 0.102, other pairs 0 to 0.3
spacing copperThickness2oz: track to track 0.203, other pairs 0.152 to 0.3
track width copperThickness1oz (default): min 0.127, default 0.254, max 2.54
track width copperThickness2oz: min 0.203, default 0.254, max 2.54
differential pair differentialPair (default): width min 0.127, default 0.254, max 2.54; gap min 0.152, default 0.152
net GND uses copperRegion

## Placement (name value [footprint] x y rotation side)
C1  100nF  [C0603]  48.39 37.85 90 top
C2  100nF  [C0603]  31.95 50.51 0 top
C3  100nF  [C0603]  39.18 34.99 90 top
C4  100nF  [C0603]  40.87 47.84 180 top
C5  100nF  [C0603]  26.8 38.61 90 top
C6  12pF  [C0603]  25.73 48.46 0 top
C7  12pF  [C0603]  26.03 41.78 0 top
C8  2.2uF  [C0603]  84.2 25.57 0 top
C9  10uF  [C0603]  76.9 16.33 0 top
C10  10uF  [C0603]  76.9 14.55 0 top
C11  10uF  [C0603]  81.27 19 180 top
C12  10uF  [C0603]  82.93 9.4 0 top
C13  100nF  [C0603]  55.12 83.06 90 top
C14  10uF  [C0603]  41.04 84.22 0 top
C15  1.5pF  [C0603]  44.32 89.03 90 top
C16  1pF  [C0603]  46.23 89.03 90 top
C17  4.7pF  [C0603]  52.58 87.88 90 top
C18  2.2nF  [C0603]  50.8 87.88 90 top
C19  33nF  [C0603]  40.99 82.45 180 top
C20  22pF  [C0603]  54.92 88.33 180 top
C21  22pF  [C0603]  57.78 82.42 0 top
C22  10uF  [C0603]  68.2 34.29 180 top
C23  100nF  [C0603]  68.2 32.26 180 top
C24  1nF  [C0603]  68.45 41.66 0 top
C25  100nF  [C0603]  68.33 37.85 0 top
C26  10uF  [C0603]  68.33 39.75 0 top
C27  100nF  [C0603]  2.99 54.03 270 top
C28  100nF  [C0603]  16.39 65.41 180 top
C29  100nF  [C0603]  86.74 64.9 180 top
C30  100nF  [C0603]  73.59 53.66 270 top
CN1  3111-08RG0BK00T1  [CONN-TH_3111-08RG0BK00T1]  91.31 34.29 270 top
CN2  ZX-XH2.54-2PWT  [CONN-SMD_2P-P2.54_MEGASTAR_ZX-XH2.54-2PWT]  93.98 20.07 90 top
L1  1.5uH  [L0603]  78.23 19 180 top
L2  3.9nH  [L0603]  41.02 87.76 0 top
L3  8.2nH  [L0603]  45.08 86.61 180 top
L4  2.7nH  [L0603]  48.89 87.88 90 top
L5  10uH  [L0603]  68.26 36.06 180 top
LED1  XL-1005UGC  [LED0402-RD_GREEN]  72.14 29.59 0 top
LED2  XL-1005UGC  [LED0402-RD_GREEN]  72.01 27.43 180 top
LED3  XL-1005UGC  [LED0402-RD_GREEN]  72.14 25.02 0 top
LED4  XL-1005UGC  [LED0402-RD_GREEN]  72.01 22.73 180 top
NOREF  -  [Pad_e221]  44.45 91.82 90 top
NOREF#2  -  [Pad_e234]  45.97 91.82 90 top
Q1  AMS1117-3.3V  [SOT-89-3_L4.5-W2.5-P1.50-LS4.2-BR]  82.12 14.56 90 top
R1  10K  [R0603]  34.91 52.01 90 top
R2  10K  [R0603]  50.1 37.8 270 top
R3  1.5Ω  [R0603]  84.25 27.53 180 top
R4  10K  [R0603]  75.07 18.92 180 top
R5  22K  [R0603]  41.02 85.72 180 top
R6  1M  [R0603]  57.78 88.39 180 top
R7  10K  [R0603]  16.89 23.5 0 top
R8  10K  [R0603]  6.6 13.21 0 top
R9  10K  [R0603]  16.7 3.31 0 top
R10  10K  [R0603]  26.6 12.77 0 top
R11  10K  [R0603]  22.99 30.61 0 top
R12  10K  [R0603]  22.92 27.56 0 top
SW1  SKRPACE010  [KEY-SMD_4P-L4.2-W3.2-P2.20-LS4.6]  53.98 37.59 0 top
SW2  SKRPACE010  [KEY-SMD_4P-L4.2-W3.2-P2.20-LS4.6]  85.73 4.57 0 top
SW3  TS-1102S-C-M-B  [KEY-SMD_4P-L6.0-W6.0-P4.50-LS8.6_TS-1102S-C-M-B]  15.49 29.72 270 top
SW4  TS-1102S-C-M-B  [KEY-SMD_4P-L6.0-W6.0-P4.50-LS8.6_TS-1102S-C-M-B]  15.24 10.03 270 top
SW5  TS-1102S-C-M-B  [KEY-SMD_4P-L6.0-W6.0-P4.50-LS8.6_TS-1102S-C-M-B]  4.95 19.94 270 top
SW6  TS-1102S-C-M-B  [KEY-SMD_4P-L6.0-W6.0-P4.50-LS8.6_TS-1102S-C-M-B]  25.15 19.56 270 top
SW7  UK-B02124G90-AQ25Y  [SW-TH_UK-B02124G90-AQ25Y]  19.43 83.31 228.4 top
SW8  UK-B02124G90-AQ25Y  [SW-TH_UK-B02124G90-AQ25Y]  77.85 84.96 127.4 top
U1  STM32F103C8T6  [LQFP-48_L7.0-W7.0-P0.50-LS9.0-BL]  35.56 43.81 270 top
U2  TP4336  [ESOP-8_L4.9-W3.9-P1.27-LS6.0-BL-EP-1]  78.25 23.95 180 top
U3  Si24R1  [QFN-20_L4.0-W4.0-P0.50-BL-EP]  48.99 83.2 0 top
U4  HS96L03W2C03  [OLED-TH_L27.8-W27.2-P2.54_C9900033791]  51.05 78.23 0 top
W1  -  [16*16双路]  15.24 53.09 0 top
W2  -  [16*16双路]  85.85 52.7 0 top
X1  8MHz  [CRYSTAL-SMD_4P-L3.2-W2.5-BL-1]  25.91 44.96 270 top
X2  16MHz  [CRYSTAL-SMD_4P-L2.5-W2.0-BL-2]  57.78 85.34 270 top

## Footprints (pads in the part's own frame, mm; a bottom-side part is the same pattern mirrored in y, then rotated)
16*16双路
  round 1.5 hole 1: 1(-10,2) 2(-10,0) 3(-10,-2) 4(-2,10) 5(0,10) 6(2,10)
  round 2.5 hole 1.5: 7(-6.75,-7.75) 8(6.75,-7.75) 9(6.75,7.75) 10(-6.75,7.75)
C0603
  rect 0.8x0.9 smd: 1(-0.7,0) 2(0.7,0)
CONN-SMD_2P-P2.54_MEGASTAR_ZX-XH2.54-2PWT
  rect 1.5x3.5 smd: 1(-1.25,3.7) 2(1.25,3.7) 3(-4.23,-3.7) 4(4.23,-3.7)
CONN-TH_3111-08RG0BK00T1
  rect 1.7x1.7 hole 1.1: 1(-3,-1)
  round 1.7 hole 1.1: 2(-3,1) 3(-1,-1) 4(-1,1) 5(1,-1) 6(1,1) 7(3,-1) 8(3,1)
CRYSTAL-SMD_4P-L2.5-W2.0-BL-2
  rect 1.2x1.1 smd: 1(-0.95,-0.75) 2(0.95,-0.75) 3(0.95,0.75) 4(-0.95,0.75)
CRYSTAL-SMD_4P-L3.2-W2.5-BL-1
  rect 1.4x1.2 smd: 1(-1.1,-0.875) 2(1.1,-0.875) 3(1.1,0.875) 4(-1.1,0.875)
ESOP-8_L4.9-W3.9-P1.27-LS6.0-BL-EP-1
  oval 0.63x1.865 smd: 1(-1.905,-2.683) 2(-0.635,-2.683) 3(0.635,-2.683) 4(1.905,-2.683) 5(1.905,2.683) 6(0.635,2.683) 7(-0.635,2.683) 8(-1.905,2.683)
  rect 3.3x2.4 smd: 9(0,0)
KEY-SMD_4P-L4.2-W3.2-P2.20-LS4.6
  rect 1.05x0.7 smd: 1(-2.1,1.075) 2(2.1,1.075) 3(-2.1,-1.075) 4(2.1,-1.075)
KEY-SMD_4P-L6.0-W6.0-P4.50-LS8.6_TS-1102S-C-M-B
  rect 2.2x1.5 smd: 1(-4.3,2.25) 2(4.3,2.25) 3(-4.3,-2.25) 4(4.3,-2.25)
L0603
  rect 0.8x0.864 smd: 1(-0.7,0) 2(0.7,0)
LED0402-RD_GREEN
  rect 0.5x0.54 smd: 1(-0.425,0) 2(0.425,0)
LQFP-48_L7.0-W7.0-P0.50-LS9.0-BL
  oval 0.27x1.5 smd: 1(-2.75,-4.25) 2(-2.25,-4.25) 3(-1.75,-4.25) 4(-1.25,-4.25) 5(-0.75,-4.25) 6(-0.25,-4.25) 7(0.25,-4.25) 8(0.75,-4.25) 9(1.25,-4.25) 10(1.75,-4.25) 11(2.25,-4.25) 12(2.75,-4.25) 25(2.75,4.25) 26(2.25,4.25) 27(1.75,4.25) 28(1.25,4.25) 29(0.75,4.25) 30(0.25,4.25) 31(-0.25,4.25) 32(-0.75,4.25) 33(-1.25,4.25) 34(-1.75,4.25) 35(-2.25,4.25) 36(-2.75,4.25)
  oval 1.5x0.27 smd: 13(4.25,-2.75) 14(4.25,-2.25) 15(4.25,-1.75) 16(4.25,-1.25) 17(4.25,-0.75) 18(4.25,-0.25) 19(4.25,0.25) 20(4.25,0.75) 21(4.25,1.25) 22(4.25,1.75) 23(4.25,2.25) 24(4.25,2.75) 37(-4.25,2.75) 38(-4.25,2.25) 39(-4.25,1.75) 40(-4.25,1.25) 41(-4.25,0.75) 42(-4.25,0.25) 43(-4.25,-0.25) 44(-4.25,-0.75) 45(-4.25,-1.25) 46(-4.25,-1.75) 47(-4.25,-2.25) 48(-4.25,-2.75)
OLED-TH_L27.8-W27.2-P2.54_C9900033791
  round 1.8 hole 1.05: 1(-3.81,0) 2(-1.27,0) 3(1.27,0) 4(3.81,0)
Pad_e221
  rect 0.2x0.2 smd: 2(0,0)
Pad_e234
  rect 0.2x0.2 smd: 1(0,0)
QFN-20_L4.0-W4.0-P0.50-BL-EP
  rect 0.28x0.8 smd: 1(-1,-2) 2(-0.5,-2) 3(0,-2) 4(0.5,-2) 5(1,-2) 11(1,2) 12(0.5,2) 13(0,2) 14(-0.5,2) 15(-1,2)
  rect 0.8x0.28 smd: 6(2,-1) 7(2,-0.5) 8(2,0) 9(2,0.5) 10(2,1) 16(-2,1) 17(-2,0.5) 18(-2,0) 19(-2,-0.5) 20(-2,-1)
  rect 2.5x2.5 smd: 21(0,0)
R0603
  rect 0.806x0.864 smd: 1(-0.753,0) 2(0.753,0)
SOT-89-3_L4.5-W2.5-P1.50-LS4.2-BR
  rect 1.575x0.672 smd: 1(1.356,-1.5) 3(1.356,1.5)
  custom 5.377x1.9 smd: 2(-1.356,0)
SW-TH_UK-B02124G90-AQ25Y
  round 1.7 hole 1.1: 1(-2.25,-1.25) 2(2.25,-1.25)
  round 2.2 hole 1.4: 3(-3.5,1.25) 4(3.5,1.25)

## Nets
As in the schematic, except:
GND: C1.1 C2.1 C3.1 C4.1 C5.1 C6.2 C7.1 C8.2 C9.1 C10.1 C11.1 C12.2 C13.1 C14.1 C16.1 C17.1 C18.1 C19.2 C20.2 C21.1 C22.1 C23.1 C24.1 C25.1 C26.1 C27.1 C28.1 C29.1 C30.1 CN1.2 CN1.7 CN2.2 CN2.3 CN2.4 NOREF.2 Q1.1 R1.2 R5.2 SW1.3 SW1.4 SW2.3 SW2.4 SW3.3 SW3.4 SW4.3 SW4.4 SW5.3 SW5.4 SW6.3 SW6.4 SW7.2 SW8.1 U1.8 U1.23 U1.35 U1.47 U2.9 U3.8 U3.14 U3.17 U3.20 U3.21 U4.1 W1.1 W1.6 W2.1 W2.6 X1.2 X1.4 X2.2 X2.4
AT1: C15.2 C16.2 NOREF#2.1

Pads without a net: CN1 1; SW7 3 4; SW8 3 4; U1 1 2 3 4 10 14 15 17 18 19 29 32 33; W1 7 8 9 10; W2 7 8 9 10

## Via types
v1: diameter 0.61, hole 0.305, Top Layer to Bottom Layer, 109 vias

## Routing (per net, layer and track width the routed paths; a pad name or vN(x,y) marks a point on that pad's centre or on a via; arc(x,y) is an arc through that point)
3V3: length 290.9
  Top Layer w0.254: U1.9 28.21,42.56 v1(27.94,42.29) ; v1(26.8,39.31) 27.5,39.31 v1(27.93,39.74) ; U3.15 47.23,85.2 v1(47.12,85.09) ; 40.08,47.75 v1(39.37,47.75) ; 40.08,47.75 C4.2 ; 40.08,47.75 39.81,47.48 U1.36 39.77,46.61 38.73,46.61 37.21,45.08 34.42,45.08 32.81,46.69 U1.48 v1(32.81,49.78) 32.81,50.35 C2.2
  Top Layer w0.3: C3.2 39.18,38.69 U1.24 ; U3.18 43.93,83.2 42.91,84.22 C14.2 ; C13.2 v1(54.71,83.35) 54.06,82.7 U3.7
  Top Layer w0.5: 43.61,35.69 47.73,35.69 arc(48.28,35.74) 48.83,35.78 R2.2 50.51,37.05 v1(51.05,37.59) ; 43.61,35.69 43.61,36.62 v1(48.13,41.15) ; 43.61,35.69 C3.2 ; v1(22.22,31.75) 22.23,31.74 R11.1 22.23,27.63 R12.1 22.17,26.99 v1(22.1,26.92) ; R8.1 v1(5.85,11.84) ; v1(82.04,17.15) 82.12,17.07 Q1.2 82.23,13.09 C12.1 ; v1(24.69,12.77) R10.1 25.85,7.56 20.45,2.16 16.89,2.16 15.94,3.11 R9.1 15,3.31 v1(14.99,3.3) ; L5.2 67.56,34.34 C22.2 67.5,32.26 C23.2 67.5,30.29 v1(67.31,30.1) ; v1(16.13,22.22) 16.14,22.23 R7.1
  Bottom Layer w0.254: v1(45.72,83.31) 45.72,83.69 v1(47.12,85.09) 53.09,85.09 54.74,83.44 ; v1(27.94,42.29) 27.94,39.75 v1(27.93,39.74)
  Bottom Layer w0.5: v1(82.04,17.15) 80.26,17.15 v1(67.31,30.1) ; v1(22.1,26.92) 17.4,22.22 v1(16.13,22.22) ; v1(49.78,58.06) 39.48,47.75 v1(39.37,47.75) ; v1(49.78,58.06) 49.78,42.8 v1(48.13,41.15) ; v1(49.78,58.06) U4.2 49.78,78.42 v1(54.71,83.35) ; v1(16.13,22.22) 24.69,13.66 v1(24.69,12.77) ; v1(16.13,22.22) 16.13,47.24 18.67,49.78 32.81,49.78 v1(32.81,49.78) ; v1(65.02,36.07) 63.5,37.59 v1(51.05,37.59) ; v1(5.85,11.84) 5.85,9.01 11.56,3.3 v1(14.99,3.3) ; v1(26.8,39.31) 22.22,34.74 v1(22.22,31.75)
  vias: v1(64.9,34.16) v1(65.4,35.18) v1(66.16,36.07) v1(66.17,34.16) v1(66.71,35.14) v1(67.31,36.07) v1(67.31,34.04)
3V3A: length 145.7
  Top Layer w0.5: W2.4 83.85,58.7 W2.3 75.85,48.36 C24.2 v1(69.15,40.71) 69.15,39.88 C26.2 C25.2 69.03,36.13 L5.1 ; W1.4 13.24,52.48 11.81,51.05 5.27,51.05 W1.3
  Bottom Layer w0.5: W1.4 13.24,68.36 31.88,87 59.56,87 W2.4
+5V: length 5.5
  Top Layer w0.5: U2.8 80.57,20.85 C11.2 80.57,15.96 Q1.3
GND: length 61.6
  Top Layer w0.2: C20.2 54.22,88.77 55.24,89.79 57.4,89.79 57.78,89.41 57.78,87.76 58.53,87.01 X2.4
  Top Layer w0.254: v1(22.99,42.04) 23.24,41.78 C7.1 25.33,43.56 X1.2 25.03,44.22 26.78,45.97 X1.4 ; v1(30.48,52.07) 29.46,51.05 v1(29.46,48.39) v1(30.2,48.39) 30.21,48.38 v1(30.21,47.62) ; 42.93,89.15 42.93,90.3 NOREF.2 ; U1.8 31.38,42.99 32.39,42.99 32.4,43 32.88,43 32.9,42.98 v1(33.4,42.98) ; U3.14 48.57,85.12 48.57,84.69 48.99,84.27 U3.21 U3.8 ; 68.9,34.29 68.9,32.26 C23.1 ; v1(26.54,50.93) 26.54,48.57 C6.2 ; X2.2 57.03,82.47 C21.1 ; C21.1 57.02,82.36 C13.1 ; C21.1 57.08,80.84 v1(57.28,80.64) ; v1(34.54,54.1) 34.91,53.73 R1.2 ; v1(34.8,45.97) 34.37,45.97 33.4,46.95 33.4,47.98 U1.47
  Bottom Layer w0.254: v1(33.4,42.98) 33.4,44.7 v1(33.15,44.96) ; v1(34.54,54.1) 34.54,58.29 32,60.83 ; v1(33.15,44.96) 32.88,44.96 v1(30.21,47.62) ; v1(33.15,44.96) 33.78,44.96 v1(34.8,45.97)
  vias: v1(30.48,52.96) v1(31.37,52.96) v1(31.37,52.2) v1(57.27,79.67) v1(57.97,80.64) v1(58.02,79.67) v1(58.67,80.64) v1(58.72,79.67) v1(65.15,40.64) v1(65.15,39.62) v1(65.15,38.73) v1(65.93,40.64) v1(65.93,39.62) v1(65.93,38.73) v1(70.61,34.54) v1(70.61,33.74) v1(70.61,32.84) v1(71.5,34.67) v1(71.5,33.71) v1(71.5,32.73)
VBAT: length 34.1
  Top Layer w0.5: U2.6 77.62,19.09 L1.2 77.6,18.93 C9.2 C10.2 77.72,14.42 77.72,10.41 80.64,7.49 86.87,7.49 90.3,10.92 90.3,18.8 90.28,18.82
VCC: length 17.1
  Top Layer w0.5: 85,27.56 90.93,27.56 92.31,28.94 CN1.8 ; 85,27.56 R3.1 ; 85,27.56 85,28.27 84.31,28.96 82.48,28.96 U2.1
ADC1-1: length 40.2
  Top Layer w0.254: C27.2 2.99,46.42 8.51,40.89 27.56,40.89 28.23,41.56 U1.11
  Top Layer w0.3: W1.2 4.99,53.33 C27.2
ADC1-2: length 51.8
  Top Layer w0.254: v1(41.66,46.16) 70.68,46.16 73.59,49.08 C30.2 ; v1(32.64,41.15) 32.56,41.06 U1.12
  Top Layer w0.3: C30.2 75.6,52.96 W2.2
  Bottom Layer w0.254: v1(32.64,41.15) 36.98,45.49 37.23,45.49 37.9,46.16 v1(41.66,46.16)
ADC1-3: length 66.4
  Top Layer w0.254: v1(48.86,49.73) 56.22,57.1 v1(56.34,57.1) ; v1(33.53,41.02) 32.81,40.3 U1.13 ; v1(80.01,64.9) C29.2
  Top Layer w0.3: W2.5 86.04,62.9 C29.2
  Bottom Layer w0.254: v1(33.53,41.02) 37.59,45.08 44.21,45.08 v1(48.86,49.73) ; v1(56.34,57.1) 64.14,64.9 v1(80.01,64.9)
ADC1-6: length 41.9
  Top Layer w0.254: v1(32.64,42.42) 33.45,41.61 33.77,41.61 34.11,41.26 34.11,40.94 34.31,40.75 U1.16 ; v1(18.8,42.93) 15.24,46.48 W1.5 15.49,63.34 15.49,65.21 C28.2
  Bottom Layer w0.254: v1(18.8,42.93) 32.13,42.93 v1(32.64,42.42)
AT1: length 4.1
  Top Layer w0.254: C16.2 46.23,91.57 NOREF#2.1
  Top Layer w0.3: C15.2 C16.2
I2C1_SCL: length 40.5
  Top Layer w0.254: v1(33.8,56.13) 52.32,74.66 U4.3 ; U1.45 v1(34.31,46.86)
  Bottom Layer w0.254: v1(34.31,46.86) 33.8,47.37 v1(33.8,56.13)
I2C1_SDA: length 38.9
  Top Layer w0.254: U4.4 54.86,76.27 33.81,55.22 U1.46
KEY-DOWN: length 56.8
  Top Layer w0.254: SW4.1 20.32,17.16 20.32,31.11 21.72,32.51 33.02,32.51 v1(33.4,32.89) ; v1(38.48,42.04) 38.51,42.06 U1.27
  Top Layer w0.3: R9.2 17.49,3.35 SW4.2 15.75,7.47 15.75,12.59 SW4.1
  Bottom Layer w0.254: v1(38.48,42.04) 38.48,37.97 v1(33.4,32.89)
KEY-LEFT: length 57.8
  Top Layer w0.254: v1(37.85,41.4) 37.9,41.45 38.72,41.45 38.83,41.56 U1.26 ; v1(35.05,35.99) 12.37,35.99 11.3,34.92 11.3,28.34 7.2,24.24
  Top Layer w0.3: 7.2,24.24 5.33,22.37 5.33,17.51 7.36,15.48 R8.2
  Bottom Layer w0.254: v1(37.85,41.4) 37.85,38.79 v1(35.05,35.99)
KEY-LEFT-X: length 80.4
  Top Layer w0.254: v1(20.07,42.04) 19.99,42.11 SW7.1 ; U1.20 36.31,32.12 34.8,30.61 R11.2 23.74,30.09 v1(23.24,29.59)
  Bottom Layer w0.254: v1(20.07,42.04) 20.07,31.11 21.59,29.59 v1(23.24,29.59)
KEY-RIGHT: length 35.9
  Top Layer w0.254: U1.25 40.39,40.49 v1(40.39,37.21) ; SW6.1 28.68,23.86 v1(28.83,24)
  Top Layer w0.3: R10.2 27.4,12.81 SW6.2 25.91,16.75 25.91,22.37 SW6.1
  Bottom Layer w0.254: v1(40.39,37.21) 40.39,35.56 v1(28.83,24)
KEY-RIGHT-X: length 103.9
  Top Layer w0.254: v1(66.68,49.66) 77.48,60.46 SW8.2 ; v1(37.97,42.8) 36.81,41.64 U1.21 36.83,39.55 36.83,32 32.39,27.56 R12.2
  Bottom Layer w0.254: v1(37.97,42.8) 43.24,42.8 47.81,38.23 55.24,38.23 v1(66.68,49.66)
KEY-UP: length 37.6
  Top Layer w0.254: SW3.1 v1(35.56,34.02) ; U1.22 37.31,34.3 v1(37.59,34.02)
  Top Layer w0.3: SW3.1 15.88,32.15 15.88,27.69 17.74,25.82 SW3.2 17.74,23.59 17.67,23.52
  Bottom Layer w0.254: v1(35.56,34.02) v1(37.59,34.02)
NRST: length 26.9
  Top Layer w0.254: U1.7 38.35,43.56 v1(38.35,43.56) ; v1(47.88,38.99) 47.94,38.99 C1.2
  Top Layer w0.3: C1.2 50.09,38.55 R2.1 51.76,38.56 SW1.1 SW1.2
  Bottom Layer w0.254: v1(38.35,43.56) 43.31,43.56 v1(47.88,38.99)
OSC_IN: length 10.8
  Top Layer w0.254: U1.5 28.59,44.56 28.07,45.08 28.07,46.74 27.43,47.37 25.03,47.37
  Top Layer w0.3: 25.03,46.06 C6.1
OSC_OUT: length 6.7
  Top Layer w0.254: U1.6 26.99,44.06 X1.3
  Top Layer w0.3: C7.2 26.78,41.83 X1.3
PA9: length 67.2
  Top Layer w0.254: v1(70.74,40.77) 94.36,40.77 96.14,38.99 96.14,34.29 95.14,33.29 CN1.6 ; U1.30 64.39,43.56 v1(66.29,41.66)
  Bottom Layer w0.254: v1(66.29,41.66) 69.85,41.66 v1(70.74,40.77)
PA10: length 62.4
  Top Layer w0.254: U1.31 64.9,44.06 v1(66.17,42.8) ; v1(93.98,41.91) 71.12,41.91 v1(70.99,42.04)
  Bottom Layer w0.254: v1(70.99,42.04) 70.23,42.8 v1(66.17,42.8) ; CN1.4 92.44,35.29 93.98,36.83 v1(93.98,41.91)
PA13/SWDIO: length 54.8
  Top Layer w0.254: U1.34 68.86,45.56 v1(69.98,44.45) ; v1(74.68,39.75) 79.14,35.29 CN1.3
  Bottom Layer w0.254: v1(69.98,44.45) v1(74.68,39.75)
PA14/SWCLK: length 58.9
  Top Layer w0.254: U1.37 39.27,49.02 69.21,49.02 v1(70.87,47.37)
  Bottom Layer w0.254: CN1.5 84.95,33.29 v1(70.87,47.37)
PA15: length 41.2
  Top Layer w0.254: U3.2 48.49,80.67 47.96,80.14 41.78,80.14 40.97,79.32 40.97,64.84 v1(37.85,61.72) ; U1.38 37.81,58 v1(37.85,58.04)
  Bottom Layer w0.254: v1(37.85,61.72) v1(37.85,58.04)
PB3: length 43.5
  Top Layer w0.254: v1(42.16,79.5) 48.01,79.5 48.99,80.49 U3.3 ; v1(37.1,56.52) 37.31,56.31 U1.39 ; v1(37.59,78.23) 37.08,77.72 v1(37.08,60.71)
  Bottom Layer w0.254: v1(37.08,60.71) 37.1,60.69 v1(37.1,56.52) ; v1(37.59,78.23) 38.86,79.5 v1(42.16,79.5)
PB4: length 47.2
  Top Layer w0.254: U1.40 36.81,46.72 v1(36.7,46.61) ; v1(41.66,75.31) 49.78,75.31 51.05,76.58 51.05,80.14 U3.5
  Bottom Layer w0.254: v1(36.7,46.61) 36.83,54.74 38.61,56.52 38.61,72.26 v1(41.66,75.31)
PB5: length 45.1
  Top Layer w0.254: U3.4 49.49,79.79 48.51,78.81 48.51,77.34 47.37,76.2 v1(41.73,76.2) ; v1(36.2,52.83) 36.31,52.73 U1.41 ; v1(36.45,76.2) 36.31,76.06 v1(36.31,59.82)
  Bottom Layer w0.254: v1(36.2,52.83) 36.2,59.71 v1(36.31,59.82) ; v1(36.45,76.2) v1(41.73,76.2)
PB6: length 52.2
  Top Layer w0.254: U3.6 52.93,82.2 57.66,77.47 57.66,77.22 41.27,60.83 41.27,50.67 v1(41.02,50.42) ; v1(35.94,45.85) 35.94,46.93 35.81,47.06 U1.42
  Bottom Layer w0.254: v1(35.94,45.85) 37.08,45.85 38.23,46.99 38.23,47.56 41.02,50.36 v1(41.02,50.42)
PB7: length 46
  Top Layer w0.254: v1(35.31,59.06) 35.31,76.96 39.55,81.2 U3.1 ; v1(35.31,46.74) 35.31,46.74 U1.43
  Bottom Layer w0.254: v1(35.31,59.06) v1(35.31,46.74)
PB15: length 74.8
  Top Layer w0.254: U1.28 61.58,42.56 63.63,40.51 63.63,30.86 70.36,24.13 70.36,22.22 73.66,18.92 R4.2
  Top Layer w0.3: SW2.1 SW2.2
  Top Layer w0.5: SW2.1 83.56,5.72 79.5,5.72 74.32,10.9 R4.2
XI: length 9.9
  Top Layer w0.3: U3.10 51.49,84.2 C20.1 55.68,88.39 R6.2 57.03,88.39 X2.1
XO: length 15.8
  Top Layer w0.254: X2.3 58.53,84.59 57.78,85.34 53.98,85.34 52.33,83.7 U3.9
  Top Layer w0.3: R6.1 59.69,87.24 59.69,85.34 58.74,84.39 X2.3 58.53,82.47 C21.2
$1N9: length 2.6
  Top Layer w0.3: U2.5 76.35,19.44 R4.1
$1N10: length 2.3
  Top Layer w0.3: 78.93,19 78.89,19.03 U2.7
$1N14: length 9.9
  Top Layer w0.3: LED4.1 72.56,22.86 LED3.2 v1(73.66,25.02) ; v1(77.6,27.94) 77.62,27.92 U2.3
  Bottom Layer w0.3: v1(77.6,27.94) 76.58,27.94 v1(73.66,25.02)
$1N15: length 11.9
  Top Layer w0.3: LED4.2 71.71,22.86 LED3.1 71.58,25.15 71.58,26.26 ; LED1.1 71.71,27.56 LED2.2 71.58,26.26 ; 71.58,26.26 75.97,26.26 U2.4
$1N16: length 10.9
  Top Layer w0.3: LED2.1 72.56,27.56 LED1.2 77.85,29.59 78.87,28.58 78.87,26.65 U2.2
$1N18: length 2
  Top Layer w0.3: C8.1 83.49,25.58 R3.2
$2N41: length 3.2
  Top Layer w0.254: U1.44 34.81,51.15 R1.1
$3N6: length 5.8
  Top Layer w0.3: R5.1 42.2,85.72 43.72,84.2 U3.16
$3N7: length 5.4
  Top Layer w0.3: U3.19 41.94,82.7 C19.1
$3N11: length 7.1
  Top Layer w0.3: 50,88.58 50,85.21 U3.11 ; 50,88.58 L4.2 ; 50,88.58 C18.2 C17.2
$3N14: length 5.6
  Top Layer w0.3: L3.1 46.35,87.18 48.89,87.18 49.49,86.58 U3.12
$3N15: length 10.8
  Top Layer w0.3: U3.13 49.02,85.23 49.02,85.85 48.64,86.23 47.12,86.23 46.38,85.5 45.5,85.5 L3.2 44.13,86.87 41.1,86.87 40.32,87.64 L2.1
$3N16: length 2.8
  Top Layer w0.3: C15.1 43.75,87.76 L2.2

## Copper pours and planes (outline as drawn; the poured copper is in the pictures)
3V3 on Top Layer: 64.39,36.7 67.92,36.7 67.92,33.58 64.39,33.58
3V3 on Bottom Layer: 47.75,59.31 51.42,59.31 51.42,55.62 47.75,55.62
3V3 on Bottom Layer: 64.39,36.7 67.92,36.7 67.92,33.58 64.39,33.58
GND on Top Layer: -15.88,113.54 121.41,113.54 121.41,-9.65 -15.88,-9.65
GND on Bottom Layer: -13.59,106.3 123.32,106.3 123.32,-8.25 -13.59,-8.25
AT1 on Top Layer: 51.9,94.64 54.38,94.64 54.38,94.14 51.9,94.14
AT1 on Top Layer: 54.08,97.28 56.38,97.28 56.38,96.78 54.08,96.78
AT1 on Top Layer: 44.08,97.28 48.28,97.28 48.28,96.78 44.08,96.78
AT1 on Top Layer: 54.08,96.96 54.58,96.96 54.58,94.14 54.08,94.14
AT1 on Top Layer: 47.78,96.96 48.28,96.96 48.28,94.14 47.78,94.14
AT1 on Top Layer: 49.98,97.28 52.38,97.28 52.38,96.78 49.98,96.78
AT1 on Top Layer: 44.08,96.98 44.98,96.98 44.98,91.68 44.08,91.68
AT1 on Top Layer: 51.88,96.96 52.38,96.96 52.38,94.14 51.88,94.14
AT1 on Top Layer: 47.87,94.63 50.41,94.63 50.41,94.14 47.87,94.14
AT1 on Top Layer: 55.88,96.96 56.38,96.96 56.38,92.84 55.88,92.84
AT1 on Top Layer: 49.98,96.96 50.48,96.96 50.48,94.14 49.98,94.14
AT1 on Top Layer: 45.78,97.01 46.28,97.01 46.28,91.68 45.78,91.68

## Text on the board
Top Silkscreen Layer: 哈哈哈哈！ | 烧录
